# EasyEDA Pro project ProPrj_ProDocument_IO_Touch_Board_v3.x_2024-08-01_2024-12-14.epro

# Schematic IO_Touch_Board_2
Create Date: 2024-07-05; Page Name: P1; Project Name: MaiPico_IO_mini; Schematic Name: IO_Touch_Board_1; Update Date: 2024-07-05; Company: 嘉立创EDA; Page Size: A4; Version: V1.0
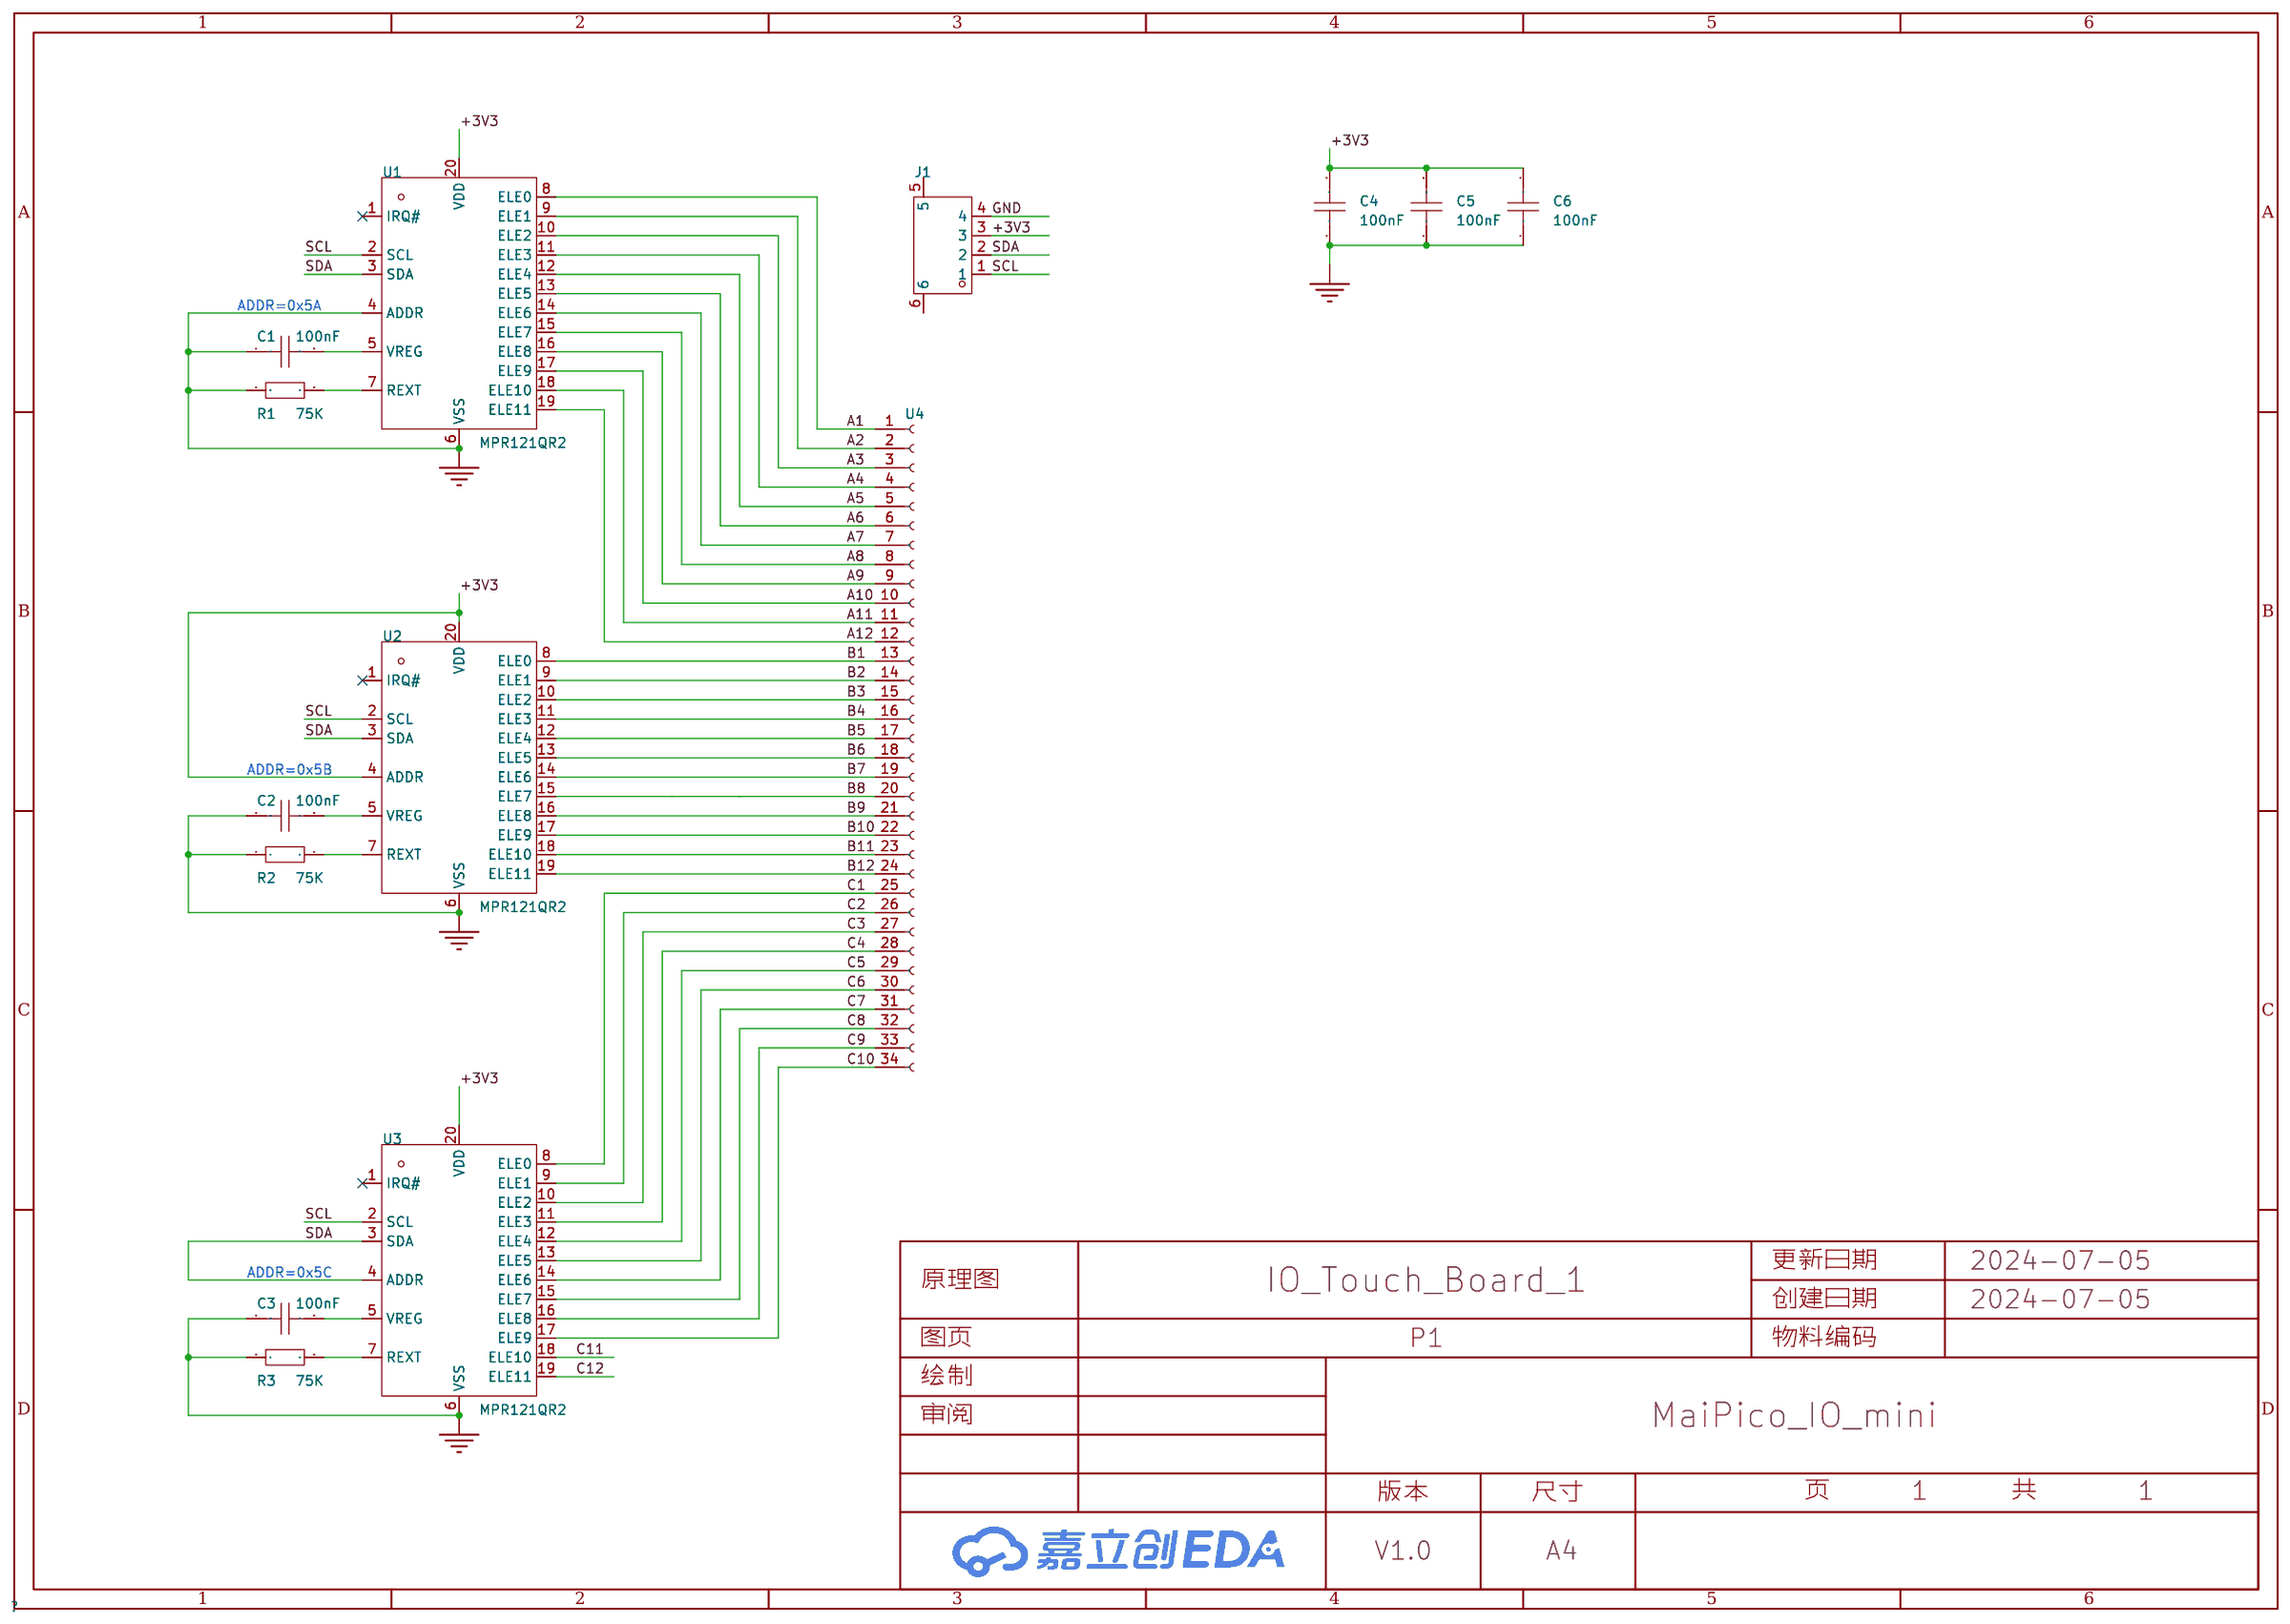
[diagram p0: schematic sheet]

## Parts
C1  100nF  [C0603]
C2  100nF  [C0603]
C3  100nF  [C0603]
C4  100nF  [C0603]
C5  100nF  [C0603]
C6  100nF  [C0603]
J1  AFA01-S04FCA-00  [FPC-SMD_4P-P1.00_JS_AFA01-S04FCA-00]
R1  75K  [R0603]
R2  75K  [R0603]
R3  75K  [R0603]
U1  MPR121QR2  [QFN-20_L3.0-W3.0-P0.40-BL]
U2  MPR121QR2  [QFN-20_L3.0-W3.0-P0.40-BL]
U3  MPR121QR2  [QFN-20_L3.0-W3.0-P0.40-BL]
U4  -  [Connector_Conn_01x34_OneSide]

## Library data of the parts
C1-C6 = CAP_0603: Supplier Footprint: 0603
J1 = AFA01-S04FCA-00: 锁定特性:翻盖式;触点类型:下接;触点数量:4P;间距:1mm;安装类型:卧贴;工作温度范围:-20℃~+85℃;; LCSC Part Name: 间距:1mm P数:4P 翻盖式 下接; Supplier Part: C262752; Manufacturer: JS(钜硕电子); Supplier Footprint: SMD,P=1mm,卧贴; JLCPCB Part Class: 扩展库; Datasheet: https://atta.szlcsc.com/upload/public/pdf/source/20180820/C262762_EBECD0847A529CA64FD00527F6604CA9.pdf; Supplier: LCSC; Locking Feature: 翻盖式; Contact Type: 下接; Number of Contacts: 4P; Pitch: 1mm; Mounting Type: 卧贴; FFC, FCB Thickness: 0.3mm; Height Above Board: 2mm; Operating Temperature Range: -20℃~+85℃
R1-R3 = Res_0603: Supplier Footprint: 0603
U1-U3 = MPR121QR2: Supplier Part: C91322; Manufacturer: NXP(恩智浦); Supplier Footprint: QFN-20(3x3); JLCPCB Part Class: 扩展库; Datasheet: https://atta.szlcsc.com/upload/public/pdf/source/20180709/C91322_1B52007B7B61B701B66428E654A9AEF1.pdf; Supplier: LCSC
U4 = Connector_Conn_01x34_OneSide

## Nets
+3V3: C4.2 C5.2 C6.2 J1.3 U1.20(VDD) U2.4(ADDR) U2.20(VDD) U3.20(VDD)
GND: C1.1 C2.1 C3.1 C4.1 C5.1 C6.1 J1.4 R1.1 R2.1 R3.1 U1.4(ADDR) U1.6(VSS) U2.6(VSS) U3.6(VSS)
A1: U1.8(ELE0) U4.1(Pin)
A2: U1.9(ELE1) U4.2(Pin)
A3: U1.10(ELE2) U4.3(Pin)
A4: U1.11(ELE3) U4.4(Pin)
A5: U1.12(ELE4) U4.5(Pin)
A6: U1.13(ELE5) U4.6(Pin)
A7: U1.14(ELE6) U4.7(Pin)
A8: U1.15(ELE7) U4.8(Pin)
A9: U1.16(ELE8) U4.9(Pin)
A10: U1.17(ELE9) U4.10(Pin)
A11: U1.18(ELE10) U4.11(Pin)
A12: U1.19(ELE11) U4.12(Pin)
B1: U2.8(ELE0) U4.13(Pin)
B2: U2.9(ELE1) U4.14(Pin)
B3: U2.10(ELE2) U4.15(Pin)
B4: U2.11(ELE3) U4.16(Pin)
B5: U2.12(ELE4) U4.17(Pin)
B6: U2.13(ELE5) U4.18(Pin)
B7: U2.14(ELE6) U4.19(Pin)
B8: U2.15(ELE7) U4.20(Pin)
B9: U2.16(ELE8) U4.21(Pin)
B10: U2.17(ELE9) U4.22(Pin)
B11: U2.18(ELE10) U4.23(Pin)
B12: U2.19(ELE11) U4.24(Pin)
C1: U3.8(ELE0) U4.25(Pin)
C2: U3.9(ELE1) U4.26(Pin)
C3: U3.10(ELE2) U4.27(Pin)
C4: U3.11(ELE3) U4.28(Pin)
C5: U3.12(ELE4) U4.29(Pin)
C6: U3.13(ELE5) U4.30(Pin)
C7: U3.14(ELE6) U4.31(Pin)
C8: U3.15(ELE7) U4.32(Pin)
C9: U3.16(ELE8) U4.33(Pin)
C10: U3.17(ELE9) U4.34(Pin)
C11: U3.18(ELE10)
C12: U3.19(ELE11)
SCL: J1.1 U1.2(SCL) U2.2(SCL) U3.2(SCL)
SDA: J1.2 U1.3(SDA) U2.3(SDA) U3.3(SDA) U3.4(ADDR)
$1N19781: C1.2 U1.5(VREG)
$1N19782: R1.2 U1.7(REXT)
$1N19783: C2.2 U2.5(VREG)
$1N19784: R2.2 U2.7(REXT)
$1N19785: R3.2 U3.7(REXT)
$1N19786: C3.2 U3.5(VREG)

Not connected (* = marked no-connect by the designer): J1 5 6; U1 1(IRQ#)*; U2 1(IRQ#)*; U3 1(IRQ#)*

## Notes on the sheet
- ADDR=0x5A
- ADDR=0x5B
- ADDR=0x5C

# Schematic IO_Touch_Board_4
Create Date: 2024-07-05; Page Name: P1; Project Name: MaiPico_IO_mini; Schematic Name: IO_Touch_Board_1; Update Date: 2024-07-05; Company: 嘉立创EDA; Page Size: A4; Version: V1.0
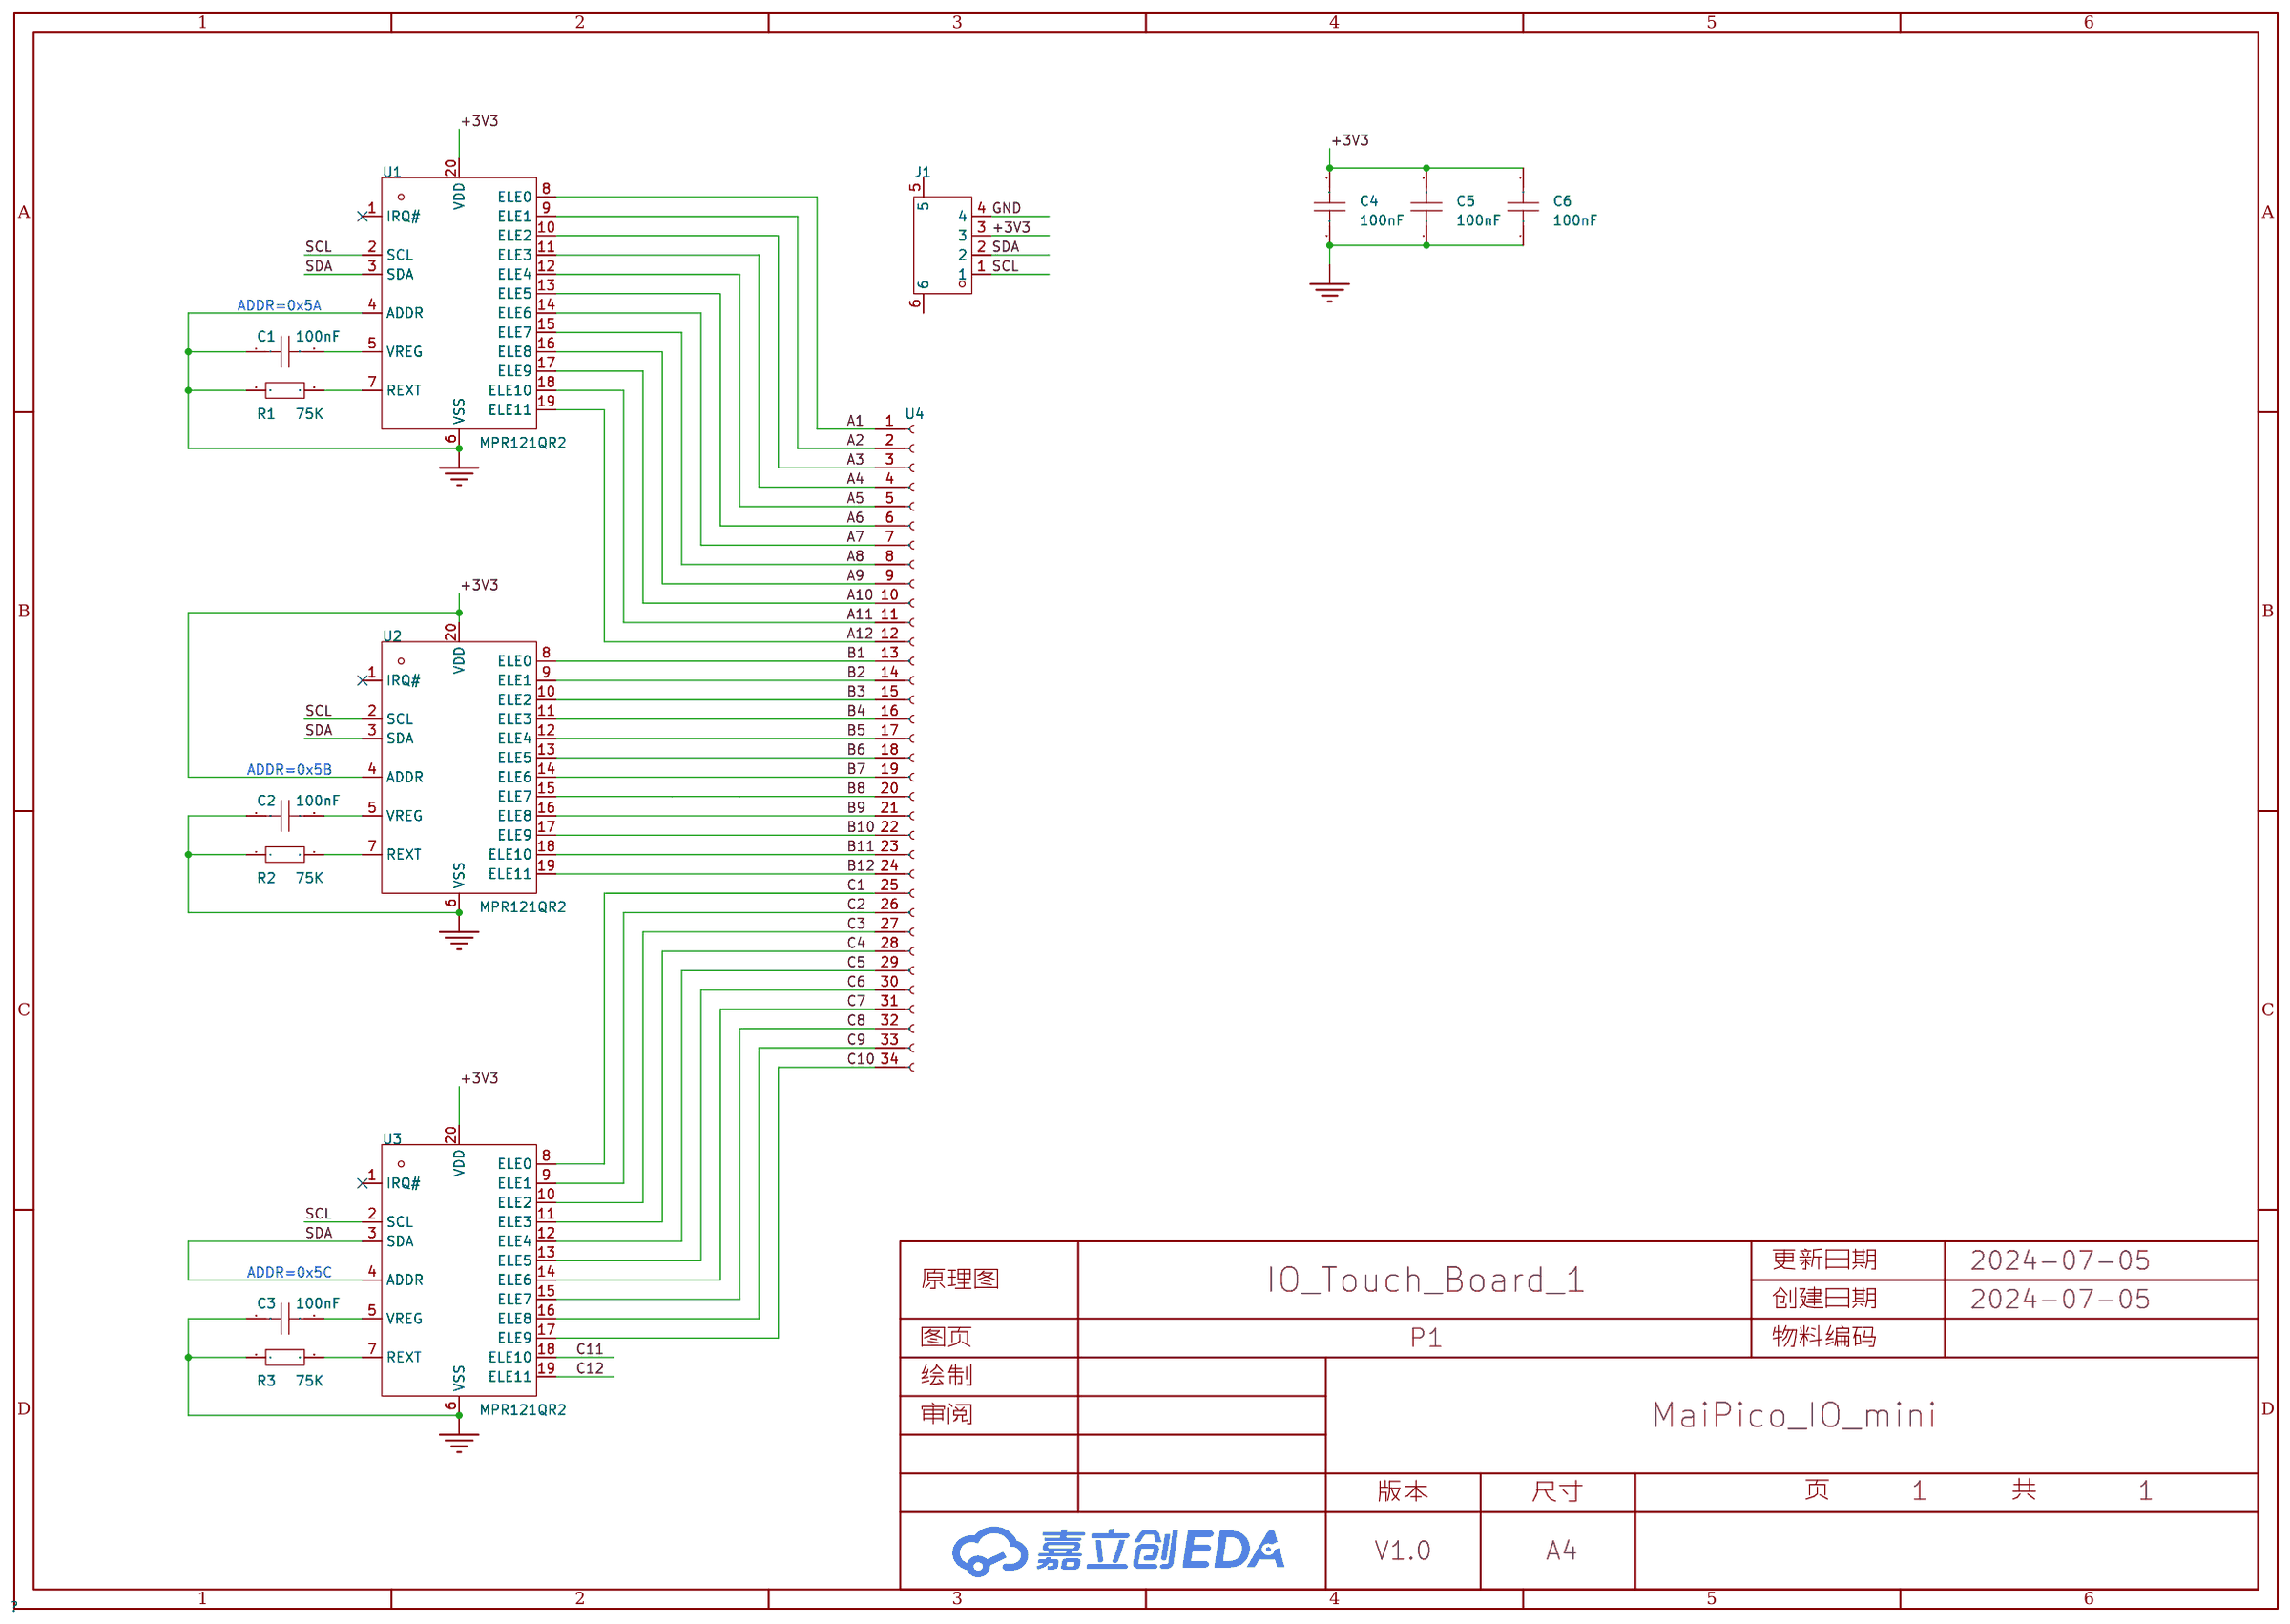
[diagram p1: schematic sheet]

## Parts
C1  100nF  [C0603]
C2  100nF  [C0603]
C3  100nF  [C0603]
C4  100nF  [C0603]
C5  100nF  [C0603]
C6  100nF  [C0603]
J1  AFA01-S04FCA-00  [FPC-SMD_4P-P1.00_JS_AFA01-S04FCA-00]
R1  75K  [R0603]
R2  75K  [R0603]
R3  75K  [R0603]
U1  MPR121QR2  [QFN-20_L3.0-W3.0-P0.40-BL]
U2  MPR121QR2  [QFN-20_L3.0-W3.0-P0.40-BL]
U3  MPR121QR2  [QFN-20_L3.0-W3.0-P0.40-BL]
U4  -  [Connector_Conn_01x34_OneSide]

## Library data of the parts
C1-C6 = CAP_0603: Supplier Footprint: 0603
J1 = AFA01-S04FCA-00: 锁定特性:翻盖式;触点类型:下接;触点数量:4P;间距:1mm;安装类型:卧贴;工作温度范围:-20℃~+85℃;; LCSC Part Name: 间距:1mm P数:4P 翻盖式 下接; Supplier Part: C262752; Manufacturer: JS(钜硕电子); Supplier Footprint: SMD,P=1mm,卧贴; JLCPCB Part Class: 扩展库; Datasheet: https://atta.szlcsc.com/upload/public/pdf/source/20180820/C262762_EBECD0847A529CA64FD00527F6604CA9.pdf; Supplier: LCSC; Locking Feature: 翻盖式; Contact Type: 下接; Number of Contacts: 4P; Pitch: 1mm; Mounting Type: 卧贴; FFC, FCB Thickness: 0.3mm; Height Above Board: 2mm; Operating Temperature Range: -20℃~+85℃
R1-R3 = Res_0603: Supplier Footprint: 0603
U1-U3 = MPR121QR2: Supplier Part: C91322; Manufacturer: NXP(恩智浦); Supplier Footprint: QFN-20(3x3); JLCPCB Part Class: 扩展库; Datasheet: https://atta.szlcsc.com/upload/public/pdf/source/20180709/C91322_1B52007B7B61B701B66428E654A9AEF1.pdf; Supplier: LCSC
U4 = Connector_Conn_01x34_OneSide

## Nets
+3V3: C4.2 C5.2 C6.2 J1.3 U1.20(VDD) U2.4(ADDR) U2.20(VDD) U3.20(VDD)
GND: C1.1 C2.1 C3.1 C4.1 C5.1 C6.1 J1.4 R1.1 R2.1 R3.1 U1.4(ADDR) U1.6(VSS) U2.6(VSS) U3.6(VSS)
A1: U1.8(ELE0) U4.1(Pin)
A2: U1.9(ELE1) U4.2(Pin)
A3: U1.10(ELE2) U4.3(Pin)
A4: U1.11(ELE3) U4.4(Pin)
A5: U1.12(ELE4) U4.5(Pin)
A6: U1.13(ELE5) U4.6(Pin)
A7: U1.14(ELE6) U4.7(Pin)
A8: U1.15(ELE7) U4.8(Pin)
A9: U1.16(ELE8) U4.9(Pin)
A10: U1.17(ELE9) U4.10(Pin)
A11: U1.18(ELE10) U4.11(Pin)
A12: U1.19(ELE11) U4.12(Pin)
B1: U2.8(ELE0) U4.13(Pin)
B2: U2.9(ELE1) U4.14(Pin)
B3: U2.10(ELE2) U4.15(Pin)
B4: U2.11(ELE3) U4.16(Pin)
B5: U2.12(ELE4) U4.17(Pin)
B6: U2.13(ELE5) U4.18(Pin)
B7: U2.14(ELE6) U4.19(Pin)
B8: U2.15(ELE7) U4.20(Pin)
B9: U2.16(ELE8) U4.21(Pin)
B10: U2.17(ELE9) U4.22(Pin)
B11: U2.18(ELE10) U4.23(Pin)
B12: U2.19(ELE11) U4.24(Pin)
C1: U3.8(ELE0) U4.25(Pin)
C2: U3.9(ELE1) U4.26(Pin)
C3: U3.10(ELE2) U4.27(Pin)
C4: U3.11(ELE3) U4.28(Pin)
C5: U3.12(ELE4) U4.29(Pin)
C6: U3.13(ELE5) U4.30(Pin)
C7: U3.14(ELE6) U4.31(Pin)
C8: U3.15(ELE7) U4.32(Pin)
C9: U3.16(ELE8) U4.33(Pin)
C10: U3.17(ELE9) U4.34(Pin)
C11: U3.18(ELE10)
C12: U3.19(ELE11)
SCL: J1.1 U1.2(SCL) U2.2(SCL) U3.2(SCL)
SDA: J1.2 U1.3(SDA) U2.3(SDA) U3.3(SDA) U3.4(ADDR)
$1N19781: C1.2 U1.5(VREG)
$1N19782: R1.2 U1.7(REXT)
$1N19783: C2.2 U2.5(VREG)
$1N19784: R2.2 U2.7(REXT)
$1N19785: R3.2 U3.7(REXT)
$1N19786: C3.2 U3.5(VREG)

Not connected (* = marked no-connect by the designer): J1 5 6; U1 1(IRQ#)*; U2 1(IRQ#)*; U3 1(IRQ#)*

## Notes on the sheet
- ADDR=0x5A
- ADDR=0x5B
- ADDR=0x5C

# Schematic IO_Touch_Board_5
Create Date: 2024-07-05; Page Name: P1; Project Name: MaiPico_IO_mini; Schematic Name: IO_Touch_Board_1; Update Date: 2024-07-05; Company: 嘉立创EDA; Page Size: A4; Version: V1.0
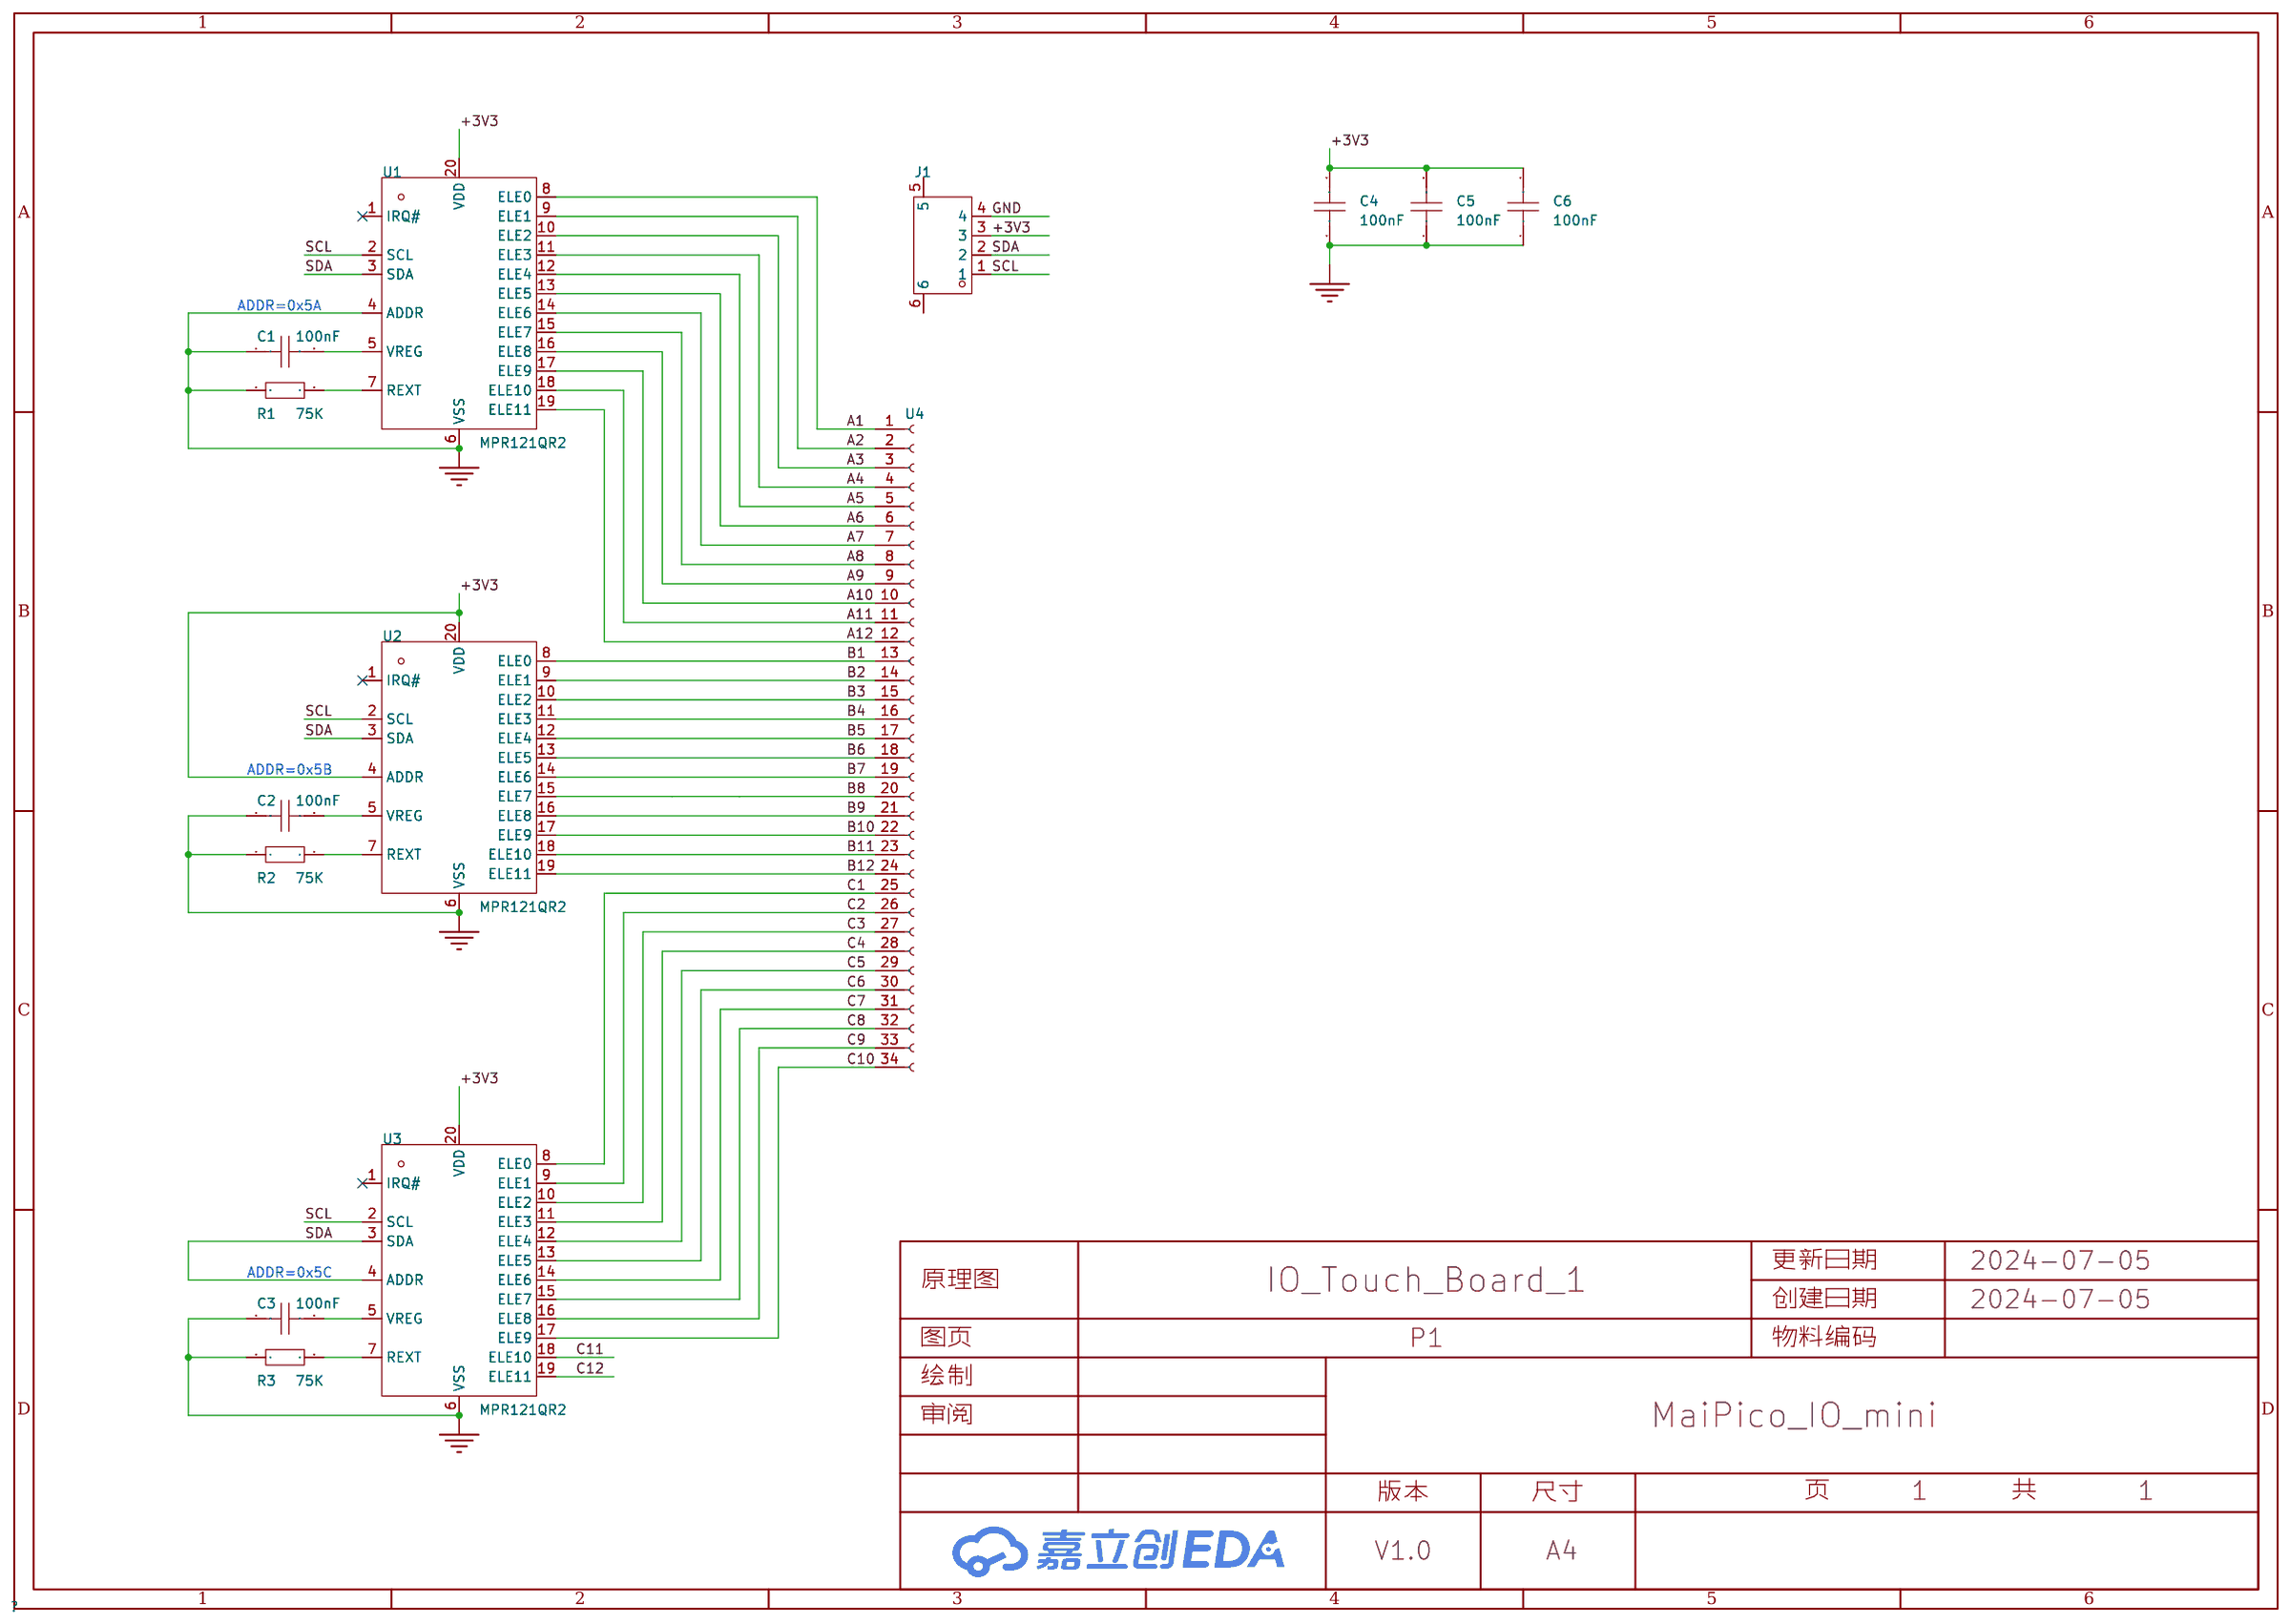
[diagram p2: schematic sheet]

## Parts
C1  100nF  [C0603]
C2  100nF  [C0603]
C3  100nF  [C0603]
C4  100nF  [C0603]
C5  100nF  [C0603]
C6  100nF  [C0603]
J1  AFA01-S04FCA-00  [FPC-SMD_4P-P1.00_JS_AFA01-S04FCA-00]
R1  75K  [R0603]
R2  75K  [R0603]
R3  75K  [R0603]
U1  MPR121QR2  [QFN-20_L3.0-W3.0-P0.40-BL]
U2  MPR121QR2  [QFN-20_L3.0-W3.0-P0.40-BL]
U3  MPR121QR2  [QFN-20_L3.0-W3.0-P0.40-BL]
U4  -  [Connector_Conn_01x34_OneSide]

## Library data of the parts
C1-C6 = CAP_0603: Supplier Footprint: 0603
J1 = AFA01-S04FCA-00: 锁定特性:翻盖式;触点类型:下接;触点数量:4P;间距:1mm;安装类型:卧贴;工作温度范围:-20℃~+85℃;; LCSC Part Name: 间距:1mm P数:4P 翻盖式 下接; Supplier Part: C262752; Manufacturer: JS(钜硕电子); Supplier Footprint: SMD,P=1mm,卧贴; JLCPCB Part Class: 扩展库; Datasheet: https://atta.szlcsc.com/upload/public/pdf/source/20180820/C262762_EBECD0847A529CA64FD00527F6604CA9.pdf; Supplier: LCSC; Locking Feature: 翻盖式; Contact Type: 下接; Number of Contacts: 4P; Pitch: 1mm; Mounting Type: 卧贴; FFC, FCB Thickness: 0.3mm; Height Above Board: 2mm; Operating Temperature Range: -20℃~+85℃
R1-R3 = Res_0603: Supplier Footprint: 0603
U1-U3 = MPR121QR2: Supplier Part: C91322; Manufacturer: NXP(恩智浦); Supplier Footprint: QFN-20(3x3); JLCPCB Part Class: 扩展库; Datasheet: https://atta.szlcsc.com/upload/public/pdf/source/20180709/C91322_1B52007B7B61B701B66428E654A9AEF1.pdf; Supplier: LCSC
U4 = Connector_Conn_01x34_OneSide

## Nets
+3V3: C4.2 C5.2 C6.2 J1.3 U1.20(VDD) U2.4(ADDR) U2.20(VDD) U3.20(VDD)
GND: C1.1 C2.1 C3.1 C4.1 C5.1 C6.1 J1.4 R1.1 R2.1 R3.1 U1.4(ADDR) U1.6(VSS) U2.6(VSS) U3.6(VSS)
A1: U1.8(ELE0) U4.1(Pin)
A2: U1.9(ELE1) U4.2(Pin)
A3: U1.10(ELE2) U4.3(Pin)
A4: U1.11(ELE3) U4.4(Pin)
A5: U1.12(ELE4) U4.5(Pin)
A6: U1.13(ELE5) U4.6(Pin)
A7: U1.14(ELE6) U4.7(Pin)
A8: U1.15(ELE7) U4.8(Pin)
A9: U1.16(ELE8) U4.9(Pin)
A10: U1.17(ELE9) U4.10(Pin)
A11: U1.18(ELE10) U4.11(Pin)
A12: U1.19(ELE11) U4.12(Pin)
B1: U2.8(ELE0) U4.13(Pin)
B2: U2.9(ELE1) U4.14(Pin)
B3: U2.10(ELE2) U4.15(Pin)
B4: U2.11(ELE3) U4.16(Pin)
B5: U2.12(ELE4) U4.17(Pin)
B6: U2.13(ELE5) U4.18(Pin)
B7: U2.14(ELE6) U4.19(Pin)
B8: U2.15(ELE7) U4.20(Pin)
B9: U2.16(ELE8) U4.21(Pin)
B10: U2.17(ELE9) U4.22(Pin)
B11: U2.18(ELE10) U4.23(Pin)
B12: U2.19(ELE11) U4.24(Pin)
C1: U3.8(ELE0) U4.25(Pin)
C2: U3.9(ELE1) U4.26(Pin)
C3: U3.10(ELE2) U4.27(Pin)
C4: U3.11(ELE3) U4.28(Pin)
C5: U3.12(ELE4) U4.29(Pin)
C6: U3.13(ELE5) U4.30(Pin)
C7: U3.14(ELE6) U4.31(Pin)
C8: U3.15(ELE7) U4.32(Pin)
C9: U3.16(ELE8) U4.33(Pin)
C10: U3.17(ELE9) U4.34(Pin)
C11: U3.18(ELE10)
C12: U3.19(ELE11)
SCL: J1.1 U1.2(SCL) U2.2(SCL) U3.2(SCL)
SDA: J1.2 U1.3(SDA) U2.3(SDA) U3.3(SDA) U3.4(ADDR)
$1N19781: C1.2 U1.5(VREG)
$1N19782: R1.2 U1.7(REXT)
$1N19783: C2.2 U2.5(VREG)
$1N19784: R2.2 U2.7(REXT)
$1N19785: R3.2 U3.7(REXT)
$1N19786: C3.2 U3.5(VREG)

Not connected (* = marked no-connect by the designer): J1 5 6; U1 1(IRQ#)*; U2 1(IRQ#)*; U3 1(IRQ#)*

## Notes on the sheet
- ADDR=0x5A
- ADDR=0x5B
- ADDR=0x5C

# Board IO_Touch_Board_v3.0_5
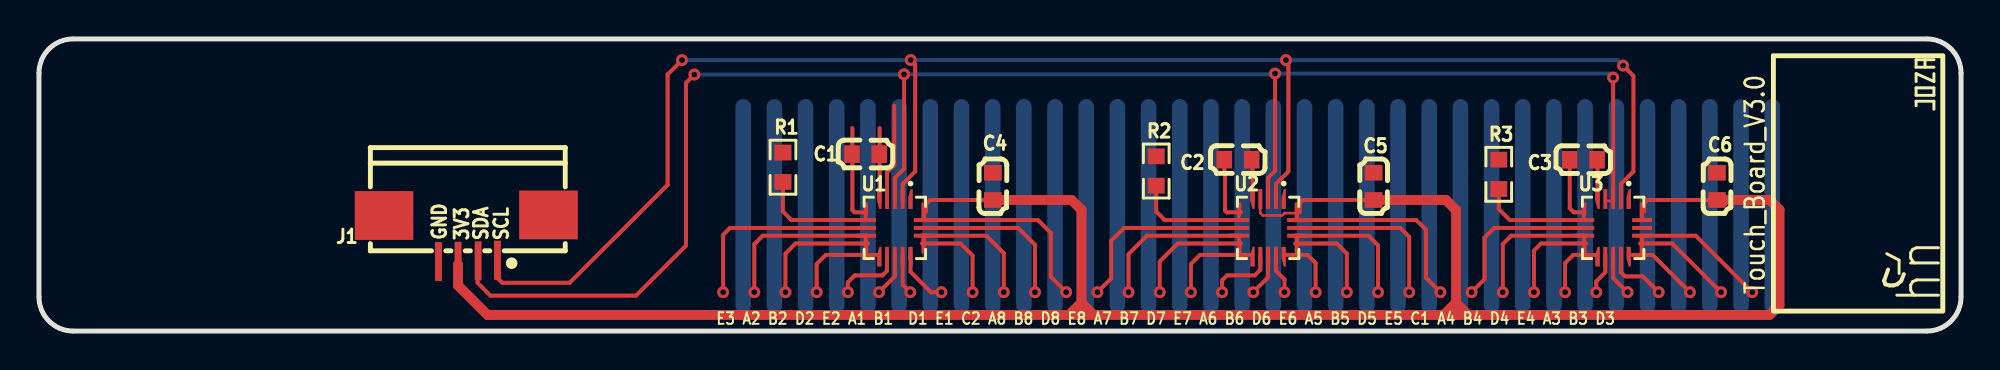
[diagram p3: board, top side]
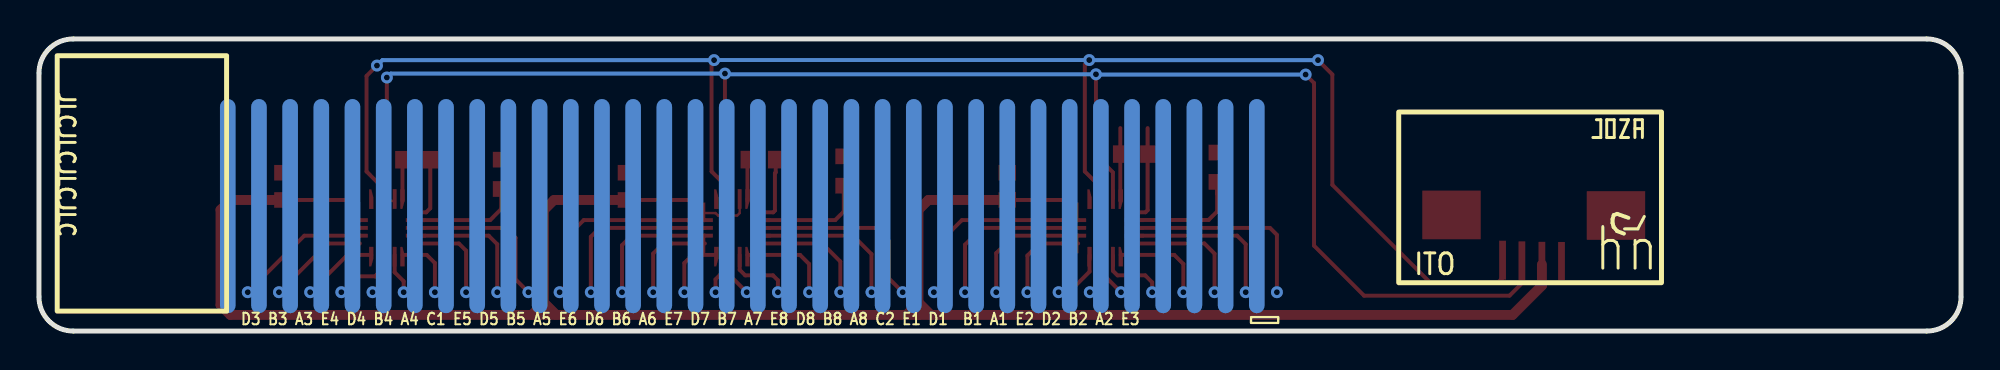
[diagram p4: board, bottom side, seen from below]

Outline 98.62 x 15 mm; copper layers: Top Layer, Bottom Layer. Coordinates in mm from the lower left corner of the outline.
Outline path: 0,13.25 arc(0.51,14.49) 1.75,15 96.87,15 arc(98.11,14.49) 98.62,13.25 98.62,1.75 arc(98.11,0.51) 96.87,0 1.75,0 arc(0.51,0.51) 0,1.75 0,13.25
Stack: Top Layer 0.035mm - / Dielectric1 1.51mm FR4 er 4.5 / Bottom Layer 0.035mm -

## Design rules (mm)
template: JLCPCB Capability(Two Layers Board)
spacing copperThickness1oz (default): track to track 0.102, other pairs 0.152 to 0.3
spacing copperThickness2oz: track to track 0.203, other pairs 0.152 to 0.3
track width copperThickness1oz (default): min 0.127, default 0.254, max 2.54
track width copperThickness2oz: min 0.203, default 0.254, max 2.54
differential pair differentialPair (default): width min 0.127, default 0.254, max 2.54; gap min 0.152, default 0.152
via viaSize (default): diameter min 0.5, default 0.61, max 10; hole min 0.3, default 0.305, max 6.3

## Placement (name value [footprint] x y rotation side)
C1  100nF  [C0603]  42.42 9.09 0 top
C2  100nF  [C0603]  61.52 8.8 0 top
C3  100nF  [C0603]  79.25 8.8 0 top
C4  100nF  [C0603]  48.94 7.43 270 top
C5  100nF  [C0603]  68.48 7.43 270 top
C6  100nF  [C0603]  86.1 7.43 270 top
J1  AFA01-S04FCA-00  [FPC-SMD_4P-P1.00_JS_AFA01-S04FCA-00]  22 4.68 180 top
R1  75K  [R0603]  38.18 8.41 270 top
R2  75K  [R0603]  57.33 8.22 270 top
R3  75K  [R0603]  74.9 8.05 270 top
U1  MPR121QR2  [QFN-20_L3.0-W3.0-P0.40-BL]  43.92 5.3 180 top
U2  MPR121QR2  [QFN-20_L3.0-W3.0-P0.40-BL]  63.07 5.3 180 top
U3  MPR121QR2  [QFN-20_L3.0-W3.0-P0.40-BL]  80.77 5.3 180 top
U4  -  [Connector_Conn_01x34_OneSide]  61.52 6.92 0 bottom

## Footprints (pads in the part's own frame, mm; a bottom-side part is the same pattern mirrored in y, then rotated)
C0603
  rect 0.8x0.9 smd: 1(-0.7,0) 2(0.7,0)
Connector_Conn_01x34_OneSide
  rrect 0.8x11 smd: 1(-25.384,0.508) 2(-23.784,0.508) 3(-22.184,0.508) 4(-20.584,0.508) 5(-18.984,0.508) 6(-17.384,0.508) 7(-15.784,0.508) 8(-14.184,0.508) 9(-12.584,0.508) 10(-10.984,0.508) 11(-9.384,0.508) 12(-7.784,0.508) 13(-6.184,0.508) 14(-4.584,0.508) 15(-2.984,0.508) 16(-1.384,0.508) 17(0.216,0.508) 18(1.816,0.508) 19(3.416,0.508) 20(5.016,0.508) 21(6.616,0.508) 22(8.216,0.508) 23(9.816,0.508) 24(11.416,0.508) 25(13.016,0.508) 26(14.616,0.508) 27(16.216,0.508) 28(17.816,0.508) 29(19.416,0.508) 30(21.016,0.508) 31(22.616,0.508) 32(24.216,0.508) 33(25.816,0.508) 34(27.416,0.508)
FPC-SMD_4P-P1.00_JS_AFA01-S04FCA-00
  rect 0.35x2 smd: 1(-1.52,1.045) 2(-0.53,1.08) 3(0.5,1.1) 4(1.505,1.11)
  rect 3x2.5 smd: 5(4.3,-1.25) 6(-4.14,-1.28)
QFN-20_L3.0-W3.0-P0.40-BL
  custom 0.224x1.006 smd: 1(-0.8,-1.478) 5(0.8,-1.478) 6(1.488,-0.8) 10(1.478,0.8) 11(0.8,1.478) 15(-0.8,1.478) 16(-1.478,0.8) 20(-1.478,-0.8)
  rect 0.2x1.016 smd: 2(-0.4,-1.483) 3(0,-1.483) 4(0.4,-1.483) 12(0.4,1.483) 13(0,1.483) 14(-0.4,1.483)
  rect 1.016x0.2 smd: 7(1.483,-0.4) 8(1.483,0) 9(1.483,0.4) 17(-1.483,0.4) 18(-1.483,0) 19(-1.483,-0.4)
R0603
  rect 0.806x0.864 smd: 1(-0.753,0) 2(0.753,0)

## Nets
As in the schematic.

Pads without a net: J1 5 6; U1 1; U2 1; U3 1

## Via types
v1: diameter 0.61, hole 0.305, Top Layer to Bottom Layer, 42 vias

## Routing (per net, layer and track width the routed paths; a pad name or vN(x,y) marks a point on that pad's centre or on a via; arc(x,y) is an arc through that point)
+3V3: length 116.5
  Top Layer w0.127: 64.42,6.06 63.91,6.06 63.78,5.93 62.8,5.93 62.67,6.06 62.67,6.69
  Top Layer w0.203: C5.2 64.86,6.73 64.69,6.57 64.69,6.1 ; 82.37,6.15 82.37,6.57 82.54,6.73 C6.2 ; C4.2 45.73,6.73 45.52,6.52 45.52,6.12
  Top Layer w0.508: 52.85,0.83 53.49,1.47 ; 53.49,1.45 54.11,0.83 ; 72.07,0.83 72.71,1.47 ; 72.71,1.45 73.33,0.83 ; C4.2 52.98,6.73 53.49,6.22 53.49,0.83 ; 72.71,0.83 72.71,6.21 72.19,6.73 C5.2 ; 72.71,0.83 53.49,0.83 ; 72.71,0.83 88.8,0.83 89.31,1.34 89.31,6.22 88.8,6.73 C6.2 ; 53.49,0.83 23.01,0.83 21.5,2.34 21.5,3.42
GND: length 16.7
  Top Layer w0.203: C3.1 78.55,6.3 78.75,6.1 U3.6 ; U1.4 43.52,8.15 43.89,8.52 43.89,11.57 ; C2.1 60.82,8.15 60.86,8.11 60.86,6.19 60.95,6.1 61.68,6.1 ; U1.6 41.85,6.1 41.74,6.21 41.74,10.42
A1: length 10.5
  Top Layer w0.203: 42.53,5.3 35.46,5.3 35.1,4.94 v1(35.1,2)
A2: length 8.5
  Top Layer w0.203: v1(36.7,2) 36.7,4.46 37.14,4.9 42.53,4.9
A3: length 6.4
  Top Layer w0.203: v1(38.3,2) 38.3,3.98 38.82,4.5 42.53,4.5
A4: length 4.9
  Top Layer w0.203: v1(39.9,2) 39.9,3.44 40.37,3.91 43.12,3.91
A5: length 3.6
  Top Layer w0.203: v1(41.5,2) 41.5,2.5 41.86,2.86 43.28,2.86 43.52,3.09 43.52,3.91
A6: length 2.3
  Top Layer w0.203: 43.92,3.91 43.92,2.81 v1(43.1,2)
A7: length 2.1
  Top Layer w0.203: 44.32,3.91 44.32,2.38 v1(44.7,2)
A8: length 2.9
  Top Layer w0.203: 44.72,3.91 44.72,3.05 45.77,2 v1(46.3,2)
A9: length 4.7
  Top Layer w0.203: v1(47.9,2) 47.9,3.88 47.28,4.5 45.3,4.5
A10: length 6.6
  Top Layer w0.203: v1(49.5,2) 49.5,4 48.61,4.9 45.3,4.9
A11: length 8.6
  Top Layer w0.203: 45.3,5.3 50.24,5.3 51.11,4.43 v1(51.11,2)
A12: length 10.3
  Top Layer w0.203: 45.3,5.7 51.26,5.7 51.92,5.04 51.92,2.78 v1(52.7,2)
B1: length 9.9
  Top Layer w0.203: 61.68,5.3 55.68,5.3 55.02,4.64 55.02,2.71 v1(54.3,2)
B2: length 8.1
  Top Layer w0.203: v1(55.91,2) 55.91,3.95 56.85,4.9 61.68,4.9
B3: length 6.1
  Top Layer w0.203: v1(57.51,2) 57.51,3.57 58.43,4.5 61.68,4.5
B4: length 4.8
  Top Layer w0.203: 62.27,3.91 59.57,3.91 59.11,3.44 v1(59.11,2)
B5: length 3.6
  Top Layer w0.203: 62.67,3.91 62.67,3.14 62.38,2.86 60.96,2.86 60.71,2.61 v1(60.71,2)
B6: length 2.2
  Top Layer w0.203: 63.07,3.91 63.07,2.76 v1(62.31,2)
B7: length 2.1
  Top Layer w0.203: v1(63.91,2) 63.91,2.66 63.47,3.09 63.47,3.91
B8: length 3.3
  Top Layer w0.203: v1(65.51,2) 65.51,3.49 65.09,3.91 63.87,3.91
B9: length 4.8
  Top Layer w0.203: v1(67.11,2) 67.11,3.98 66.59,4.5 64.46,4.5
B10: length 6.9
  Top Layer w0.203: v1(68.71,2) 68.71,4.41 68.22,4.9 64.46,4.9
B11: length 8.9
  Top Layer w0.203: 64.46,5.3 69.85,5.3 70.31,4.84 v1(70.31,2)
B12: length 10.4
  Top Layer w0.203: v1(71.91,2) 71.17,2.73 71.17,5.2 70.67,5.7 64.46,5.7
C1: length 8.5
  Top Layer w0.203: v1(73.51,2) 74.17,2.66 74.17,4.79 74.68,5.3 79.38,5.3
C2: length 6.9
  Top Layer w0.203: v1(75.11,2) 75.11,4.46 75.55,4.9 79.38,4.9
C3: length 5
  Top Layer w0.203: 79.38,4.5 77.08,4.5 76.71,4.13 v1(76.71,2)
C4: length 3.3
  Top Layer w0.203: v1(78.31,2) 78.31,3.49 78.72,3.91 79.97,3.91
C5: length 2.1
  Top Layer w0.203: 80.37,3.91 80.37,3.02 79.91,2.55 v1(79.91,2)
C6: length 2.2
  Top Layer w0.203: v1(81.51,2) 80.77,2.73 80.77,3.91
C7: length 3.3
  Top Layer w0.203: v1(83.11,2) 82.3,2.81 81.38,2.81 81.17,3.02 81.17,3.91
C8: length 3.9
  Top Layer w0.203: 81.57,3.91 82.79,3.91 v1(84.71,2)
C9: length 5.2
  Top Layer w0.203: 82.16,4.5 83.81,4.5 v1(86.31,2)
C10: length 7
  Top Layer w0.203: v1(87.91,2) 85.01,4.9 82.16,4.9
SCL: length 89.3
  Top Layer w0.203: 23.5,3.42 23.5,2.75 23.77,2.48 27.23,2.48 32.26,7.51 32.26,13.18 v1(32.99,13.91) ; 44.32,6.69 44.32,7.55 44.96,8.19 44.96,13.69 v1(44.73,13.92) ; v1(81.28,13.63) 81.81,13.1 81.81,8.19 81.17,7.55 81.17,6.69 ; 63.47,6.69 63.47,7.55 64.11,8.19 64.11,13.79 v1(63.98,13.91)
  Bottom Layer w0.203: v1(32.99,13.91) 44.73,13.91 v1(44.73,13.92) 63.98,13.92 v1(63.98,13.91) 81,13.91 v1(81.28,13.63)
SDA: length 89.3
  Top Layer w0.127: 80.77,6.69 80.37,6.69
  Top Layer w0.203: v1(63.42,13.22) 63.42,8.22 63.07,7.86 63.07,6.69 ; v1(80.77,13.02) 80.77,6.69 ; 43.92,6.69 43.92,7.86 44.39,8.33 v1(44.39,13.19) ; v1(33.63,13.17) 33.2,12.74 33.2,4.38 30.63,1.82 23.17,1.82 22.5,2.48 22.5,3.42
  Bottom Layer w0.203: v1(80.77,13.02) 80.57,13.22 v1(63.42,13.22) 63.39,13.19 v1(44.39,13.19) 44.37,13.17 v1(33.63,13.17)
$1N19781: length 3.7
  Top Layer w0.203: 43.12,6.69 43.14,6.7 43.14,10.42
$1N19782: length 6.1
  Top Layer w0.203: 42.53,5.7 42.52,5.7 38.61,5.7 38.17,6.14 38.17,7.05 38.18,7.05 R1.2
$1N19783: length 2.1
  Top Layer w0.203: 62.27,8.75 62.27,6.69
$1N19784: length 5.9
  Top Layer w0.203: 61.69,5.69 61.68,5.7 57.77,5.7 57.33,6.14 57.33,7.47
$1N19785: length 5.8
  Top Layer w0.203: 79.39,5.69 79.38,5.7 75.47,5.7 74.9,6.26 R3.2
$1N19786: length 2.1
  Top Layer w0.203: 79.97,6.69 79.97,8.77

## Copper pours and planes (outline as drawn; the poured copper is in the pictures)
GND on Top Layer: -8.92,20.51 102.74,20.51 102.74,-5.12 -8.92,-5.12

## Text on the board
Bottom Silkscreen Layer: D3 B3 A3 E4 D4 B4 A4 C1 E5 D5 B5 A5 E6 D6 B6 A6 E7 D7 B7 A7 E8 D8 B8 A8 C2 E1 D1  B1 A1 E2 D2 B2 A2 E3 | JLCJLCJLCJLC | ITO | hn | つ
Top Silkscreen Layer: E3 A2 B2 D2 E2 A1 B1  D1 E1 C2 A8 B8 D8 E8 A7 B7 D7 E7 A6 B6 D6 E6 A5 B5 D5 E5 C1 A4 B4 D4 E4 A3 B3 D3 | GND | 3V3 | SDA | SCL | Touch_Board_V3.0 | hn | つ

# Board IO_Touch_Board_v3.0_4
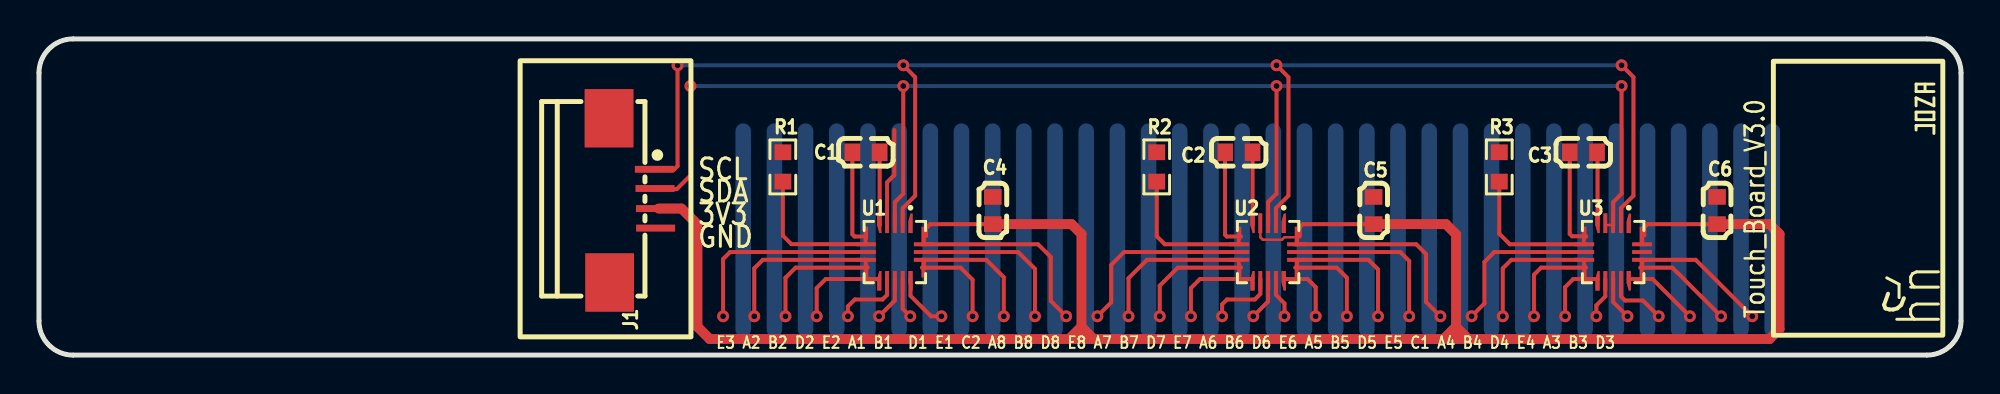
[diagram p5: board, top side]
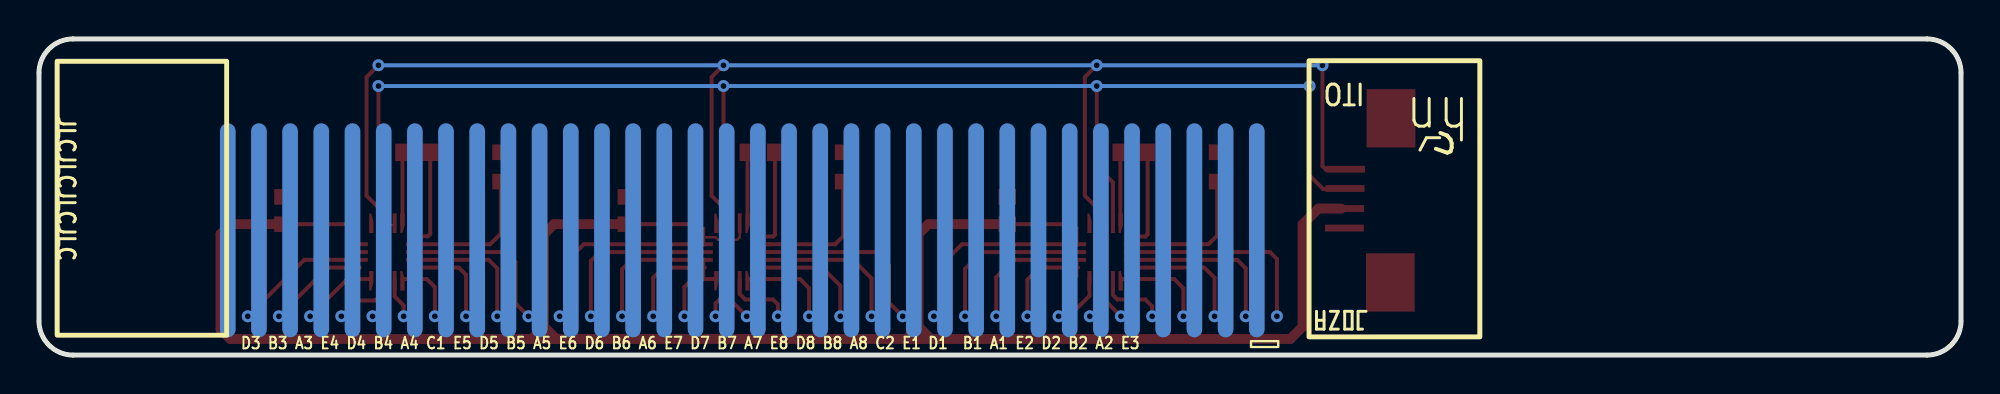
[diagram p6: board, bottom side, seen from below]

Outline 98.62 x 16.25 mm; copper layers: Top Layer, Bottom Layer. Coordinates in mm from the lower left corner of the outline.
Outline path: 0,14.5 arc(0.51,15.74) 1.75,16.25 96.87,16.25 arc(98.11,15.74) 98.62,14.5 98.62,1.75 arc(98.11,0.51) 96.87,0 1.75,0 arc(0.51,0.51) 0,1.75 0,14.5
Stack: Top Layer 0.035mm - / Dielectric1 1.51mm FR4 er 4.5 / Bottom Layer 0.035mm -

## Design rules (mm)
template: JLCPCB Capability(Two Layers Board)
spacing copperThickness1oz (default): track to track 0.102, other pairs 0.152 to 0.3
spacing copperThickness2oz: track to track 0.203, other pairs 0.152 to 0.3
track width copperThickness1oz (default): min 0.127, default 0.254, max 2.54
track width copperThickness2oz: min 0.203, default 0.254, max 2.54
differential pair differentialPair (default): width min 0.127, default 0.254, max 2.54; gap min 0.152, default 0.152
via viaSize (default): diameter min 0.5, default 0.61, max 10; hole min 0.3, default 0.305, max 6.3

## Placement (name value [footprint] x y rotation side)
C1  100nF  [C0603]  42.44 10.42 0 top
C2  100nF  [C0603]  61.57 10.42 0 top
C3  100nF  [C0603]  79.25 10.42 0 top
C4  100nF  [C0603]  48.94 7.43 270 top
C5  100nF  [C0603]  68.48 7.43 270 top
C6  100nF  [C0603]  86.1 7.43 270 top
J1  AFA01-S04FCA-00  [FPC-SMD_4P-P1.00_JS_AFA01-S04FCA-00]  30.53 8.03 270 top
R1  75K  [R0603]  38.17 9.67 270 top
R2  75K  [R0603]  57.35 9.67 270 top
R3  75K  [R0603]  74.93 9.67 270 top
U1  MPR121QR2  [QFN-20_L3.0-W3.0-P0.40-BL]  43.92 5.3 180 top
U2  MPR121QR2  [QFN-20_L3.0-W3.0-P0.40-BL]  63.07 5.3 180 top
U3  MPR121QR2  [QFN-20_L3.0-W3.0-P0.40-BL]  80.77 5.3 180 top
U4  -  [Connector_Conn_01x34_OneSide]  61.52 6.92 0 bottom

## Footprints (pads in the part's own frame, mm; a bottom-side part is the same pattern mirrored in y, then rotated)
C0603
  rect 0.8x0.9 smd: 1(-0.7,0) 2(0.7,0)
Connector_Conn_01x34_OneSide
  rrect 0.8x11 smd: 1(-25.384,0.508) 2(-23.784,0.508) 3(-22.184,0.508) 4(-20.584,0.508) 5(-18.984,0.508) 6(-17.384,0.508) 7(-15.784,0.508) 8(-14.184,0.508) 9(-12.584,0.508) 10(-10.984,0.508) 11(-9.384,0.508) 12(-7.784,0.508) 13(-6.184,0.508) 14(-4.584,0.508) 15(-2.984,0.508) 16(-1.384,0.508) 17(0.216,0.508) 18(1.816,0.508) 19(3.416,0.508) 20(5.016,0.508) 21(6.616,0.508) 22(8.216,0.508) 23(9.816,0.508) 24(11.416,0.508) 25(13.016,0.508) 26(14.616,0.508) 27(16.216,0.508) 28(17.816,0.508) 29(19.416,0.508) 30(21.016,0.508) 31(22.616,0.508) 32(24.216,0.508) 33(25.816,0.508) 34(27.416,0.508)
FPC-SMD_4P-P1.00_JS_AFA01-S04FCA-00
  rect 0.35x2 smd: 1(-1.52,1.045) 2(-0.53,1.08) 3(0.5,1.1) 4(1.505,1.11)
  rect 3x2.5 smd: 5(4.3,-1.25) 6(-4.14,-1.28)
QFN-20_L3.0-W3.0-P0.40-BL
  custom 0.224x1.006 smd: 1(-0.8,-1.478) 5(0.8,-1.478) 6(1.488,-0.8) 10(1.478,0.8) 11(0.8,1.478) 15(-0.8,1.478) 16(-1.478,0.8) 20(-1.478,-0.8)
  rect 0.2x1.016 smd: 2(-0.4,-1.483) 3(0,-1.483) 4(0.4,-1.483) 12(0.4,1.483) 13(0,1.483) 14(-0.4,1.483)
  rect 1.016x0.2 smd: 7(1.483,-0.4) 8(1.483,0) 9(1.483,0.4) 17(-1.483,0.4) 18(-1.483,0) 19(-1.483,-0.4)
R0603
  rect 0.806x0.864 smd: 1(-0.753,0) 2(0.753,0)

## Nets
As in the schematic.

Pads without a net: J1 5 6; U1 1; U2 1; U3 1

## Via types
v1: diameter 0.61, hole 0.305, Top Layer to Bottom Layer, 42 vias

## Routing (per net, layer and track width the routed paths; a pad name or vN(x,y) marks a point on that pad's centre or on a via; arc(x,y) is an arc through that point)
+3V3: length 110.4
  Top Layer w0.127: 62.67,6.69 62.67,6.06 62.8,5.93 63.78,5.93 63.91,6.06 64.42,6.06
  Top Layer w0.203: 82.37,6.15 82.37,6.57 82.54,6.73 C6.2 ; 64.69,6.1 64.69,6.57 64.86,6.73 C5.2 ; C4.2 45.73,6.73 45.52,6.52 45.52,6.12
  Top Layer w0.508: 52.85,0.83 53.49,1.47 ; 53.49,1.45 54.11,0.83 ; 72.07,0.83 72.71,1.47 ; 72.71,1.45 73.33,0.83 ; 53.49,0.83 34.42,0.83 33.78,1.46 33.78,6.72 32.97,7.53 31.79,7.53 ; 53.49,0.83 72.71,0.83 ; 53.49,0.83 53.49,6.22 52.98,6.73 C4.2 ; 72.71,0.83 72.71,6.21 72.19,6.73 C5.2 ; 72.71,0.83 88.8,0.83 89.31,1.34 89.31,6.22 88.8,6.73 C6.2
GND: length 20.1
  Top Layer w0.203: C3.1 78.55,6.23 78.66,6.11 79.37,6.11 79.38,6.1 ; U1.4 43.52,8.89 43.89,9.26 43.89,11.57 ; C2.1 60.86,10.41 60.86,6.19 60.95,6.1 61.68,6.1 ; C1.1 41.74,6.21 41.85,6.1 U1.6
A1: length 10.5
  Top Layer w0.203: 42.53,5.3 35.46,5.3 35.1,4.94 v1(35.1,2)
A2: length 8.5
  Top Layer w0.203: 42.53,4.9 37.14,4.9 36.7,4.46 v1(36.7,2)
A3: length 6.4
  Top Layer w0.203: v1(38.3,2) 38.3,3.98 38.82,4.5 42.53,4.5
A4: length 4.9
  Top Layer w0.203: v1(39.9,2) 39.9,3.44 40.37,3.91 43.12,3.91
A5: length 3.6
  Top Layer w0.203: 43.52,3.91 43.52,3.09 43.28,2.86 41.86,2.86 41.5,2.5 v1(41.5,2)
A6: length 2.3
  Top Layer w0.203: v1(43.1,2) 43.92,2.81 43.92,3.91
A7: length 2.1
  Top Layer w0.203: 44.32,3.91 44.32,2.38 v1(44.7,2)
A8: length 2.9
  Top Layer w0.203: 44.72,3.91 44.72,3.05 45.77,2 v1(46.3,2)
A9: length 4.7
  Top Layer w0.203: 45.3,4.5 47.28,4.5 47.9,3.88 v1(47.9,2)
A10: length 6.6
  Top Layer w0.203: v1(49.5,2) 49.5,4 48.61,4.9 45.3,4.9
A11: length 8.6
  Top Layer w0.203: 45.3,5.3 50.24,5.3 51.11,4.43 v1(51.11,2)
A12: length 10.3
  Top Layer w0.203: v1(52.7,2) 51.92,2.78 51.92,5.04 51.26,5.7 45.3,5.7
B1: length 9.9
  Top Layer w0.203: v1(54.3,2) 55.02,2.71 55.02,4.64 55.68,5.3 61.68,5.3
B2: length 8.1
  Top Layer w0.203: v1(55.91,2) 55.91,3.95 56.85,4.9 61.68,4.9
B3: length 6.1
  Top Layer w0.203: 61.68,4.5 58.43,4.5 57.51,3.57 v1(57.51,2)
B4: length 4.8
  Top Layer w0.203: v1(59.11,2) 59.11,3.44 59.57,3.91 62.27,3.91
B5: length 3.6
  Top Layer w0.203: 62.67,3.91 62.67,3.14 62.38,2.86 60.96,2.86 60.71,2.61 v1(60.71,2)
B6: length 2.2
  Top Layer w0.203: 63.07,3.91 63.07,2.76 v1(62.31,2)
B7: length 2.1
  Top Layer w0.203: v1(63.91,2) 63.91,2.66 63.47,3.09 63.47,3.91
B8: length 3.3
  Top Layer w0.203: 63.87,3.91 65.09,3.91 65.51,3.49 v1(65.51,2)
B9: length 4.8
  Top Layer w0.203: 64.46,4.5 66.59,4.5 67.11,3.98 v1(67.11,2)
B10: length 6.9
  Top Layer w0.203: v1(68.71,2) 68.71,4.41 68.22,4.9 64.46,4.9
B11: length 8.9
  Top Layer w0.203: v1(70.31,2) 70.31,4.84 69.85,5.3 64.46,5.3
B12: length 10.4
  Top Layer w0.203: 64.46,5.7 70.67,5.7 71.17,5.2 71.17,2.73 v1(71.91,2)
C1: length 8.5
  Top Layer w0.203: v1(73.51,2) 74.17,2.66 74.17,4.79 74.68,5.3 79.38,5.3
C2: length 6.9
  Top Layer w0.203: 79.38,4.9 75.55,4.9 75.11,4.46 v1(75.11,2)
C3: length 5
  Top Layer w0.203: v1(76.71,2) 76.71,4.13 77.08,4.5 79.38,4.5
C4: length 3.3
  Top Layer w0.203: 79.97,3.91 78.72,3.91 78.31,3.49 v1(78.31,2)
C5: length 2.1
  Top Layer w0.203: 80.37,3.91 80.37,3.02 79.91,2.55 v1(79.91,2)
C6: length 2.2
  Top Layer w0.203: 80.77,3.91 80.77,2.73 v1(81.51,2)
C7: length 3.3
  Top Layer w0.203: 81.17,3.91 81.17,3.02 81.38,2.81 82.3,2.81 v1(83.11,2)
C8: length 3.9
  Top Layer w0.203: v1(84.71,2) 82.79,3.91 81.57,3.91
C9: length 5.2
  Top Layer w0.203: 82.16,4.5 83.81,4.5 v1(86.31,2)
C10: length 7
  Top Layer w0.203: 82.16,4.9 85.01,4.9 v1(87.91,2)
SCL: length 81.1
  Top Layer w0.203: v1(32.77,14.9) 32.77,9.72 32.58,9.53 31.79,9.53 ; v1(44.35,14.9) 44.96,14.29 44.96,8.19 44.32,7.55 44.32,6.69 ; 81.17,6.69 81.17,7.55 81.81,8.19 81.81,14.29 v1(81.2,14.9) ; 63.47,6.69 63.47,7.55 64.11,8.19 64.11,14.29 v1(63.5,14.9)
  Bottom Layer w0.203: 32.77,15.1 32.97,14.9 v1(44.35,14.9) ; 63.5,15.1 63.7,14.9 v1(81.2,14.9) ; v1(63.5,14.9) 44.55,14.9 44.35,15.1
SDA: length 76.7
  Top Layer w0.127: 80.37,6.69 80.77,6.69
  Top Layer w0.203: v1(44.35,13.83) 44.35,8.29 43.92,7.86 43.92,6.69 ; v1(63.5,13.83) 63.5,8.29 63.07,7.86 63.07,6.69 ; 31.79,8.53 32.73,8.53 33.43,9.23 v1(33.43,13.83) ; 80.77,6.69 80.77,7.86 81.2,8.29 v1(81.2,13.83)
  Bottom Layer w0.203: v1(81.2,13.83) v1(63.5,13.83) v1(44.35,13.83) v1(33.43,13.83)
$1N19781: length 3.7
  Top Layer w0.203: 43.12,6.69 43.14,6.7 C1.2
$1N19782: length 7.3
  Top Layer w0.203: 42.53,5.7 42.52,5.7 38.61,5.7 38.17,6.14 R1.2
$1N19783: length 3.8
  Top Layer w0.203: 62.27,6.69 62.27,10.37 62.32,10.42
$1N19784: length 7.3
  Top Layer w0.203: 61.69,5.69 61.68,5.7 57.77,5.7 57.35,6.11 57.35,8.89 57.33,8.91
$1N19785: length 7.4
  Top Layer w0.203: 79.39,5.69 79.38,5.7 75.47,5.7 74.93,6.24 R3.2
$1N19786: length 3.7
  Top Layer w0.203: 79.97,6.69 79.97,10.4 C3.2

## Copper pours and planes (outline as drawn; the poured copper is in the pictures)
GND on Top Layer: -8.76,20.59 102.9,20.59 102.9,-5.04 -8.76,-5.04

## Text on the board
Bottom Silkscreen Layer: D3 B3 A3 E4 D4 B4 A4 C1 E5 D5 B5 A5 E6 D6 B6 A6 E7 D7 B7 A7 E8 D8 B8 A8 C2 E1 D1  B1 A1 E2 D2 B2 A2 E3 | JLCJLCJLCJLC | ITO | hn | つ
Top Silkscreen Layer: E3 A2 B2 D2 E2 A1 B1  D1 E1 C2 A8 B8 D8 E8 A7 B7 D7 E7 A6 B6 D6 E6 A5 B5 D5 E5 C1 A4 B4 D4 E4 A3 B3 D3 | Touch_Board_V3.0 | SCL | SDA | 3V3 | GND | hn | つ

# Board IO_Touch_Board_v3.0_3
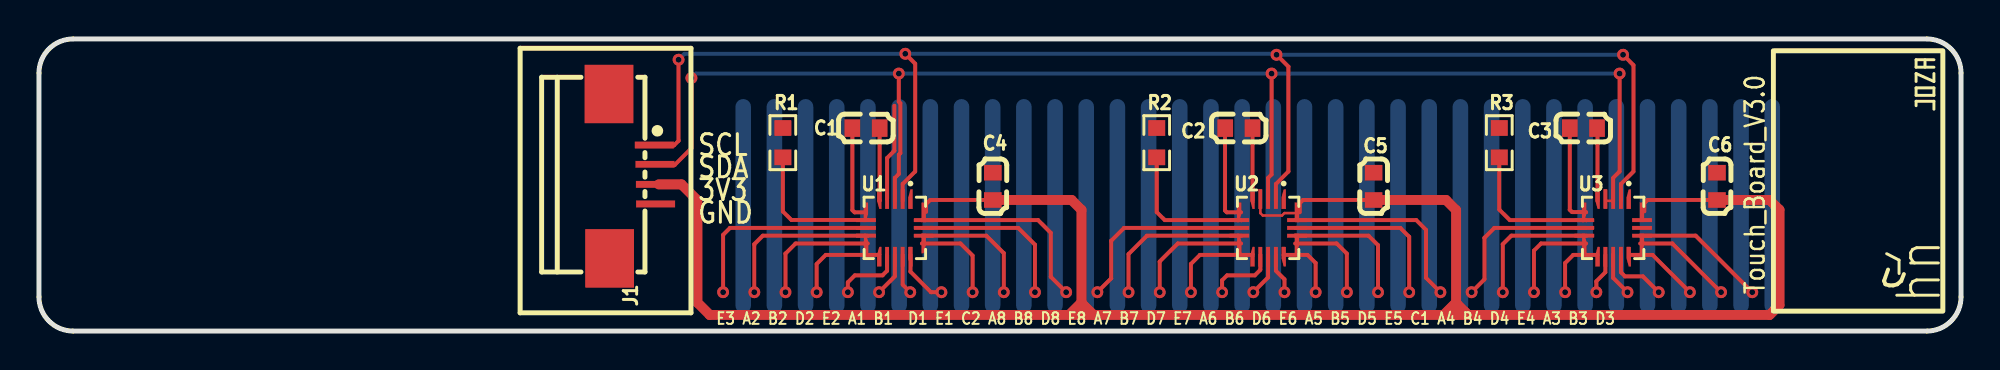
[diagram p7: board, top side]
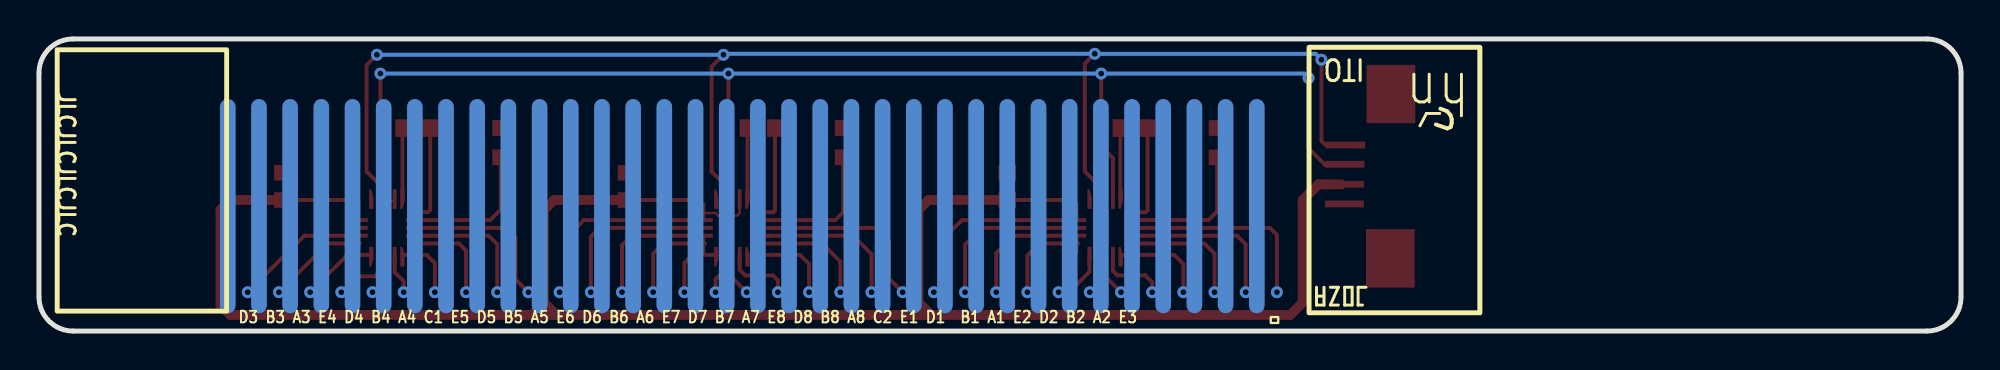
[diagram p8: board, bottom side, seen from below]

Outline 98.62 x 15 mm; copper layers: Top Layer, Bottom Layer. Coordinates in mm from the lower left corner of the outline.
Outline path: 0,13.25 arc(0.51,14.49) 1.75,15 96.87,15 arc(98.11,14.49) 98.62,13.25 98.62,1.75 arc(98.11,0.51) 96.87,0 1.75,0 arc(0.51,0.51) 0,1.75 0,13.25
Stack: Top Layer 0.035mm - / Dielectric1 1.51mm FR4 er 4.5 / Bottom Layer 0.035mm -

## Design rules (mm)
template: JLCPCB Capability(Two Layers Board)
spacing copperThickness1oz (default): track to track 0.102, other pairs 0.152 to 0.3
spacing copperThickness2oz: track to track 0.203, other pairs 0.152 to 0.3
track width copperThickness1oz (default): min 0.127, default 0.254, max 2.54
track width copperThickness2oz: min 0.203, default 0.254, max 2.54
differential pair differentialPair (default): width min 0.127, default 0.254, max 2.54; gap min 0.152, default 0.152
via viaSize (default): diameter min 0.5, default 0.61, max 10; hole min 0.3, default 0.305, max 6.3

## Placement (name value [footprint] x y rotation side)
C1  100nF  [C0603]  42.44 10.42 0 top
C2  100nF  [C0603]  61.57 10.42 0 top
C3  100nF  [C0603]  79.25 10.42 0 top
C4  100nF  [C0603]  48.94 7.43 270 top
C5  100nF  [C0603]  68.48 7.43 270 top
C6  100nF  [C0603]  86.1 7.43 270 top
J1  AFA01-S04FCA-00  [FPC-SMD_4P-P1.00_JS_AFA01-S04FCA-00]  30.53 8.03 270 top
R1  75K  [R0603]  38.17 9.67 270 top
R2  75K  [R0603]  57.35 9.67 270 top
R3  75K  [R0603]  74.93 9.67 270 top
U1  MPR121QR2  [QFN-20_L3.0-W3.0-P0.40-BL]  43.92 5.3 180 top
U2  MPR121QR2  [QFN-20_L3.0-W3.0-P0.40-BL]  63.07 5.3 180 top
U3  MPR121QR2  [QFN-20_L3.0-W3.0-P0.40-BL]  80.77 5.3 180 top
U4  -  [Connector_Conn_01x34_OneSide]  61.52 6.92 0 bottom

## Footprints (pads in the part's own frame, mm; a bottom-side part is the same pattern mirrored in y, then rotated)
C0603
  rect 0.8x0.9 smd: 1(-0.7,0) 2(0.7,0)
Connector_Conn_01x34_OneSide
  rrect 0.8x11 smd: 1(-25.384,0.508) 2(-23.784,0.508) 3(-22.184,0.508) 4(-20.584,0.508) 5(-18.984,0.508) 6(-17.384,0.508) 7(-15.784,0.508) 8(-14.184,0.508) 9(-12.584,0.508) 10(-10.984,0.508) 11(-9.384,0.508) 12(-7.784,0.508) 13(-6.184,0.508) 14(-4.584,0.508) 15(-2.984,0.508) 16(-1.384,0.508) 17(0.216,0.508) 18(1.816,0.508) 19(3.416,0.508) 20(5.016,0.508) 21(6.616,0.508) 22(8.216,0.508) 23(9.816,0.508) 24(11.416,0.508) 25(13.016,0.508) 26(14.616,0.508) 27(16.216,0.508) 28(17.816,0.508) 29(19.416,0.508) 30(21.016,0.508) 31(22.616,0.508) 32(24.216,0.508) 33(25.816,0.508) 34(27.416,0.508)
FPC-SMD_4P-P1.00_JS_AFA01-S04FCA-00
  rect 0.35x2 smd: 1(-1.52,1.045) 2(-0.53,1.08) 3(0.5,1.1) 4(1.505,1.11)
  rect 3x2.5 smd: 5(4.3,-1.25) 6(-4.14,-1.28)
QFN-20_L3.0-W3.0-P0.40-BL
  custom 0.224x1.006 smd: 1(-0.8,-1.478) 5(0.8,-1.478) 6(1.488,-0.8) 10(1.478,0.8) 11(0.8,1.478) 15(-0.8,1.478) 16(-1.478,0.8) 20(-1.478,-0.8)
  rect 0.2x1.016 smd: 2(-0.4,-1.483) 3(0,-1.483) 4(0.4,-1.483) 12(0.4,1.483) 13(0,1.483) 14(-0.4,1.483)
  rect 1.016x0.2 smd: 7(1.483,-0.4) 8(1.483,0) 9(1.483,0.4) 17(-1.483,0.4) 18(-1.483,0) 19(-1.483,-0.4)
R0603
  rect 0.806x0.864 smd: 1(-0.753,0) 2(0.753,0)

## Nets
As in the schematic.

Pads without a net: J1 5 6; U1 1; U2 1; U3 1

## Via types
v1: diameter 0.61, hole 0.305, Top Layer to Bottom Layer, 42 vias

## Routing (per net, layer and track width the routed paths; a pad name or vN(x,y) marks a point on that pad's centre or on a via; arc(x,y) is an arc through that point)
+3V3: length 110.4
  Top Layer w0.127: 62.67,6.69 62.67,6.06 62.8,5.93 63.78,5.93 63.91,6.06 64.42,6.06
  Top Layer w0.203: 64.69,6.1 64.69,6.57 64.86,6.73 C5.2 ; 45.52,6.12 45.52,6.52 45.73,6.73 C4.2 ; C6.2 82.54,6.73 82.37,6.57 82.37,6.15
  Top Layer w0.508: 52.85,0.83 53.49,1.47 ; 53.49,1.45 54.11,0.83 ; 72.07,0.83 72.71,1.47 ; 72.71,1.45 73.33,0.83 ; 31.79,7.53 32.97,7.53 33.78,6.72 33.78,1.46 34.42,0.83 53.49,0.83 ; C5.2 72.19,6.73 72.71,6.21 72.71,0.83 ; 72.71,0.83 88.8,0.83 89.31,1.34 89.31,6.22 88.8,6.73 C6.2 ; 72.71,0.83 53.49,0.83 ; 53.49,0.83 53.49,6.22 52.98,6.73 C4.2
GND: length 20.1
  Top Layer w0.203: 43.89,11.57 43.89,9.26 43.52,8.89 U1.4 ; 79.38,6.1 79.37,6.11 78.66,6.11 78.55,6.23 C3.1 ; U1.6 41.85,6.1 41.74,6.21 C1.1 ; C2.1 60.86,10.41 60.86,6.19 60.95,6.1 61.68,6.1
A1: length 10.5
  Top Layer w0.203: 42.53,5.3 35.46,5.3 35.1,4.94 v1(35.1,2)
A2: length 8.5
  Top Layer w0.203: v1(36.7,2) 36.7,4.46 37.14,4.9 42.53,4.9
A3: length 6.4
  Top Layer w0.203: v1(38.3,2) 38.3,3.98 38.82,4.5 42.53,4.5
A4: length 4.9
  Top Layer w0.203: 43.12,3.91 40.37,3.91 39.9,3.44 v1(39.9,2)
A5: length 3.6
  Top Layer w0.203: v1(41.5,2) 41.5,2.5 41.86,2.86 43.28,2.86 43.52,3.09 43.52,3.91
A6: length 2.3
  Top Layer w0.203: v1(43.1,2) 43.92,2.81 43.92,3.91
A7: length 2.1
  Top Layer w0.203: v1(44.7,2) 44.32,2.38 44.32,3.91
A8: length 2.9
  Top Layer w0.203: v1(46.3,2) 45.77,2 44.72,3.05 44.72,3.91
A9: length 4.7
  Top Layer w0.203: 45.3,4.5 47.28,4.5 47.9,3.88 v1(47.9,2)
A10: length 6.6
  Top Layer w0.203: 45.3,4.9 48.61,4.9 49.5,4 v1(49.5,2)
A11: length 8.6
  Top Layer w0.203: 45.3,5.3 50.24,5.3 51.11,4.43 v1(51.11,2)
A12: length 10.3
  Top Layer w0.203: 45.3,5.7 51.26,5.7 51.92,5.04 51.92,2.78 v1(52.7,2)
B1: length 9.9
  Top Layer w0.203: 61.68,5.3 55.68,5.3 55.02,4.64 55.02,2.71 v1(54.3,2)
B2: length 8.1
  Top Layer w0.203: 61.68,4.9 56.85,4.9 55.91,3.95 v1(55.91,2)
B3: length 6.1
  Top Layer w0.203: v1(57.51,2) 57.51,3.57 58.43,4.5 61.68,4.5
B4: length 4.8
  Top Layer w0.203: v1(59.11,2) 59.11,3.44 59.57,3.91 62.27,3.91
B5: length 3.6
  Top Layer w0.203: v1(60.71,2) 60.71,2.61 60.96,2.86 62.38,2.86 62.67,3.14 62.67,3.91
B6: length 2.2
  Top Layer w0.203: v1(62.31,2) 63.07,2.76 63.07,3.91
B7: length 2.1
  Top Layer w0.203: v1(63.91,2) 63.91,2.66 63.47,3.09 63.47,3.91
B8: length 3.3
  Top Layer w0.203: 63.87,3.91 65.09,3.91 65.51,3.49 v1(65.51,2)
B9: length 4.8
  Top Layer w0.203: v1(67.11,2) 67.11,3.98 66.59,4.5 64.46,4.5
B10: length 6.9
  Top Layer w0.203: 64.46,4.9 68.22,4.9 68.71,4.41 v1(68.71,2)
B11: length 8.9
  Top Layer w0.203: v1(70.31,2) 70.31,4.84 69.85,5.3 64.46,5.3
B12: length 10.4
  Top Layer w0.203: 64.46,5.7 70.67,5.7 71.17,5.2 71.17,2.73 v1(71.91,2)
C1: length 8.5
  Top Layer w0.203: v1(73.51,2) 74.17,2.66 74.17,4.79 74.68,5.3 79.38,5.3
C2: length 6.9
  Top Layer w0.203: v1(75.11,2) 75.11,4.46 75.55,4.9 79.38,4.9
C3: length 5
  Top Layer w0.203: v1(76.71,2) 76.71,4.13 77.08,4.5 79.38,4.5
C4: length 3.3
  Top Layer w0.203: v1(78.31,2) 78.31,3.49 78.72,3.91 79.97,3.91
C5: length 2.1
  Top Layer w0.203: 80.37,3.91 80.37,3.02 79.91,2.55 v1(79.91,2)
C6: length 2.2
  Top Layer w0.203: 80.77,3.91 80.77,2.73 v1(81.51,2)
C7: length 3.3
  Top Layer w0.203: v1(83.11,2) 82.3,2.81 81.38,2.81 81.17,3.02 81.17,3.91
C8: length 3.9
  Top Layer w0.203: v1(84.71,2) 82.79,3.91 81.57,3.91
C9: length 5.2
  Top Layer w0.203: 82.16,4.5 83.81,4.5 v1(86.31,2)
C10: length 7
  Top Layer w0.203: v1(87.91,2) 85.01,4.9 82.16,4.9
SCL: length 77.9
  Top Layer w0.203: v1(44.45,14.24) 44.96,13.73 44.96,8.19 44.32,7.55 44.32,6.69 ; 31.79,9.53 32.58,9.53 32.82,9.77 v1(32.82,13.93) ; v1(81.28,14.19) 81.81,13.65 81.81,8.19 81.17,7.55 81.17,6.69 ; v1(63.5,14.19) 64.11,13.58 64.11,8.19 63.47,7.55 63.47,6.69
  Bottom Layer w0.203: v1(32.82,13.93) 33.12,14.23 44.45,14.23 v1(44.45,14.24) 63.45,14.24 v1(63.5,14.19) v1(81.28,14.19)
SDA: length 73.7
  Top Layer w0.127: 80.77,6.69 80.37,6.69
  Top Layer w0.203: v1(63.25,13.22) 63.25,8.04 63.07,7.86 63.07,6.69 ; 31.79,8.53 32.62,8.53 33.48,9.39 v1(33.48,12.99) ; 43.92,6.69 43.92,7.86 44.12,8.07 44.12,9.06 44.2,9.13 44.2,11.7 44.12,11.77 v1(44.12,13.22) ; v1(81.1,13.22) 81.1,8.19 80.77,7.86 80.77,6.69
  Bottom Layer w0.203: v1(33.48,12.99) 33.71,13.22 v1(44.12,13.22) v1(63.25,13.22) v1(81.1,13.22)
$1N19781: length 3.7
  Top Layer w0.203: 43.12,6.69 43.14,6.7 C1.2
$1N19782: length 7.3
  Top Layer w0.203: 42.53,5.7 42.52,5.7 38.61,5.7 38.17,6.14 R1.2
$1N19783: length 3.8
  Top Layer w0.203: 62.27,6.69 62.27,10.37 62.32,10.42
$1N19784: length 7.3
  Top Layer w0.203: 57.33,8.91 57.35,8.89 57.35,6.11 57.77,5.7 61.68,5.7 61.69,5.69
$1N19785: length 7.4
  Top Layer w0.203: R3.2 74.93,6.24 75.47,5.7 79.38,5.7 79.39,5.69
$1N19786: length 3.7
  Top Layer w0.203: C3.2 79.97,10.4 79.97,6.69

## Copper pours and planes (outline as drawn; the poured copper is in the pictures)
GND on Top Layer: -8.76,20.59 102.9,20.59 102.9,-5.04 -8.76,-5.04

## Text on the board
Bottom Silkscreen Layer: D3 B3 A3 E4 D4 B4 A4 C1 E5 D5 B5 A5 E6 D6 B6 A6 E7 D7 B7 A7 E8 D8 B8 A8 C2 E1 D1  B1 A1 E2 D2 B2 A2 E3 | JLCJLCJLCJLC | ITO | hn | つ
Top Silkscreen Layer: E3 A2 B2 D2 E2 A1 B1  D1 E1 C2 A8 B8 D8 E8 A7 B7 D7 E7 A6 B6 D6 E6 A5 B5 D5 E5 C1 A4 B4 D4 E4 A3 B3 D3 | Touch_Board_V3.0 | SCL | SDA | 3V3 | GND | hn | つ
